# Altium project TMSVC5509A.PrjPcb
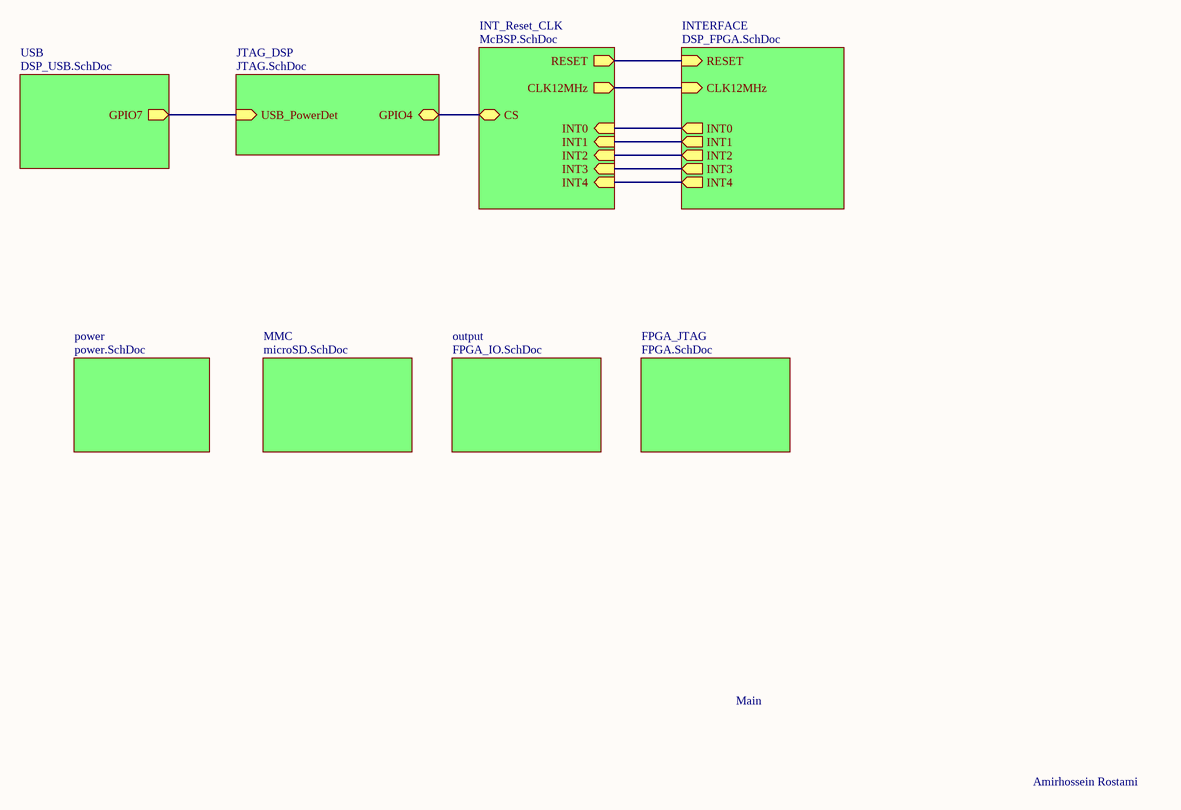
[diagram p0: main.SchDoc]
9 sheets, 303 parts. Net scope: hierarchical (ports join the sheet entries above them; power ports are global).
Board file: DSP5509_FPGACIII.PcbDoc
Sheets:
  main.SchDoc
    USB = DSP_USB.SchDoc
    JTAG_DSP = JTAG.SchDoc
    INT_Reset_CLK = McBSP.SchDoc
    INTERFACE = DSP_FPGA.SchDoc
    FPGA_JTAG = FPGA.SchDoc
    power = power.SchDoc
    MMC = microSD.SchDoc
    output = FPGA_IO.SchDoc

## Sheet main.SchDoc
size A4

### Sub-sheets
FPGA_JTAG = FPGA.SchDoc: no entries
INT_Reset_CLK = McBSP.SchDoc: CS, RESET (out), CLK12MHz (out), INT0 (in), INT1 (in), INT2 (in), INT3 (in), INT4 (in)
INTERFACE = DSP_FPGA.SchDoc: RESET (in), CLK12MHz (in), INT0 (out), INT1 (out), INT2 (out), INT3 (out), INT4 (out)
JTAG_DSP = JTAG.SchDoc: GPIO4, USB_PowerDet (in)
MMC = microSD.SchDoc: no entries
output = FPGA_IO.SchDoc: no entries
power = power.SchDoc: no entries
USB = DSP_USB.SchDoc: GPIO7 (out)

### Nets
CLK12MHz: sheet INT_Reset_CLK/CLK12MHz, sheet INTERFACE/CLK12MHz
NetR2_2: sheet USB/GPIO7, sheet JTAG_DSP/USB_PowerDet
NetR27_1: sheet JTAG_DSP/GPIO4, sheet INT_Reset_CLK/CS
NetR50_1: sheet INT_Reset_CLK/INT0, sheet INTERFACE/INT0
NetR51_1: sheet INT_Reset_CLK/INT1, sheet INTERFACE/INT1
NetR52_1: sheet INT_Reset_CLK/INT2, sheet INTERFACE/INT2
NetR53_1: sheet INT_Reset_CLK/INT3, sheet INTERFACE/INT3
NetR54_1: sheet INT_Reset_CLK/INT4, sheet INTERFACE/INT4
NetR145_2: sheet INT_Reset_CLK/RESET, sheet INTERFACE/RESET

### Notes on the sheet
- Main
- Amirhossein Rostami

## Sheet DSP_USB.SchDoc
size A4
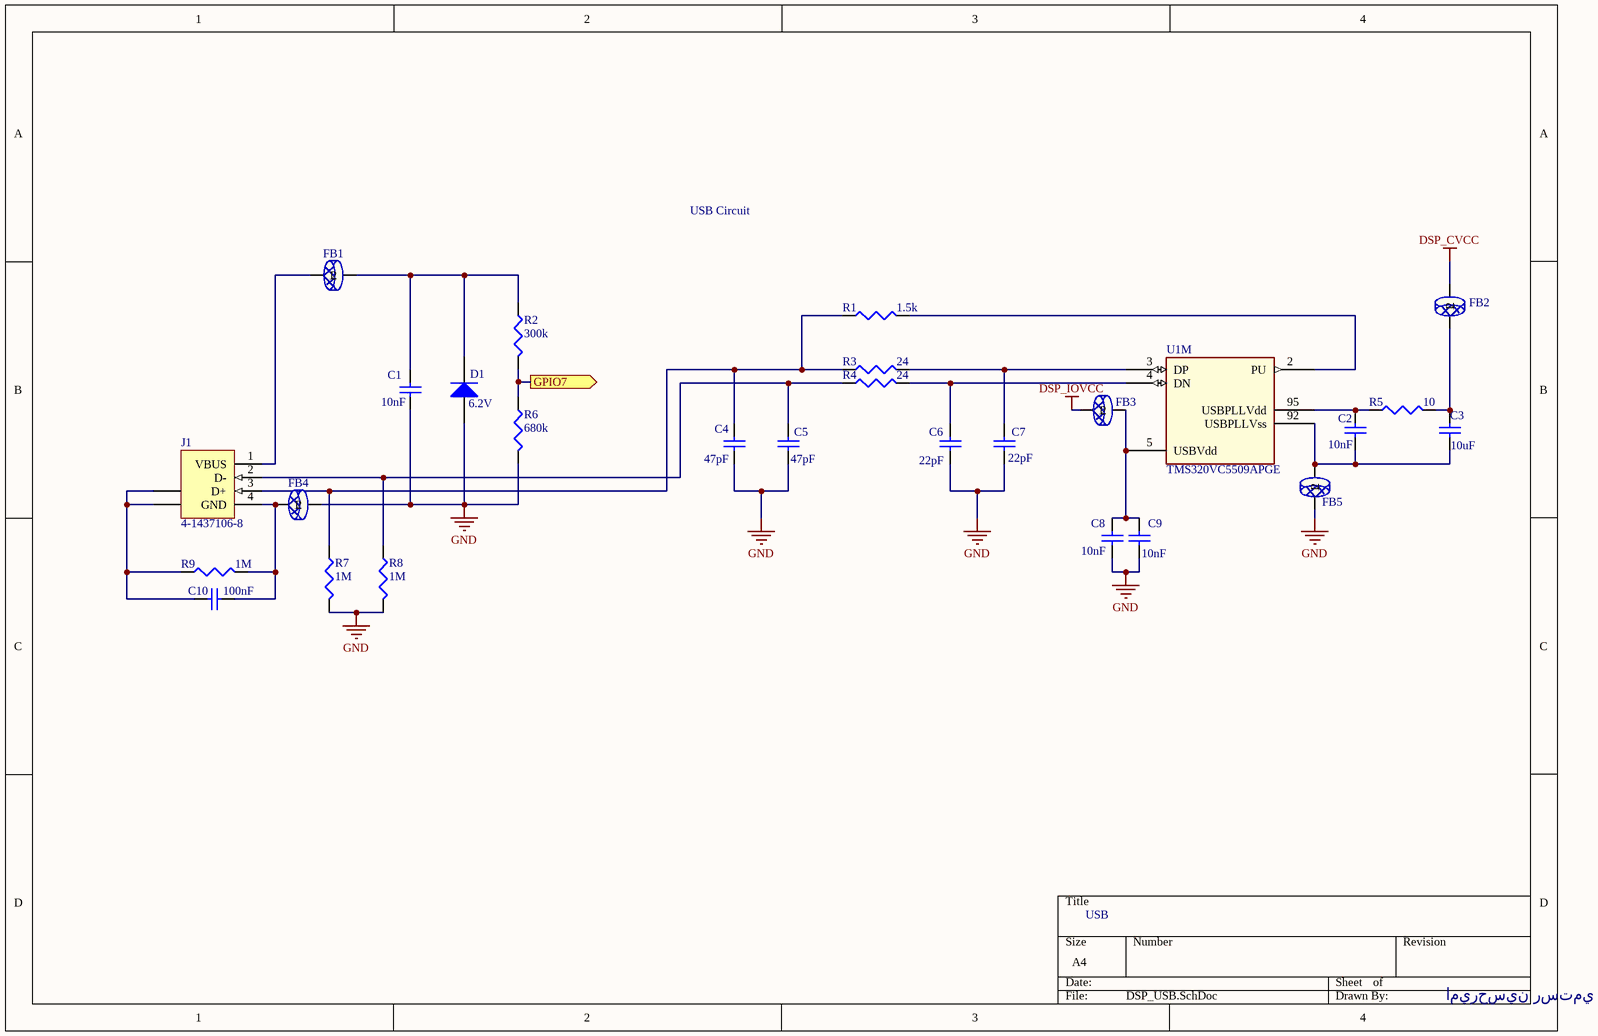
[diagram p1: DSP_USB.SchDoc]

### Parts
C1  10nF  [1608[0603]]
C2  10nF  [1608[0603]]
C3  10uF  [C1206]
C4  47pF  [1608[0603]]
C5  47pF  [1608[0603]]
C6  22pF  [1608[0603]]
C7  value 22pF  [1608[0603]]  (hidden comment: 24pF)
C8  10nF  [1608[0603]]
C9  10nF  [1608[0603]]
C10  100nF  [1608[0603]]
D1  6.2V  [MELF-D3513-1405]
FB1  50  [3216[1206]]  (value not drawn)
FB2  50  [3216[1206]]  (value not drawn)
FB3  50  [3216[1206]]  (value not drawn)
FB4  50  [3216[1206]]  (value not drawn)
FB5  50  [3216[1206]]  (value not drawn)
J1  4-1437106-8  [1437106]
R1  1.5k  [J1-0603]
R2  300k  [J1-0603]
R3  24  [J1-0603]
R4  24  [J1-0603]
R5  10  [J1-0603]
R6  680k  [J1-0603]
R7  1M  [J1-0603]
R8  1M  [J1-0603]
R9  1M  [J1-0603]
U1  TMS320VC5509APGE  [TMSVC5509APGA]  (part M of 16)

### Ports
GPIO7 (out)

### Nets
DSP_CVCC: FB2.1
DSP_IOVCC: FB3.2  [project net +3.3V]
GND: C1.2 C4.2 C5.2 C6.2 C7.2 C8.2 C9.2 D1.1(A) FB4.1 FB5.2 R6.2 R7.2 R8.2
NetC1_1: C1.1 D1.2(K) FB1.1 R2.1
NetC2_1: C2.1 R5.1 U1.95(USBPLLVdd)
NetC2_2: C2.2 C3.2 FB5.1 U1.92(USBPLLVss)
NetC3_1: C3.1 FB2.2 R5.2
NetC4_1: C4.1 J1.3(D+) R1.1 R3.1 R7.1
NetC5_1: C5.1 J1.2(D-) R4.1 R8.1
NetC6_1: C6.1 R4.2 U1.4(DN)
NetC7_1: C7.1 R3.2 U1.3(DP)
NetC8_1: C8.1 C9.1 FB3.1 U1.5(USBVdd)
NetC10_1: C10.1 FB4.2 J1.4(GND) R9.2
NetC10_2: C10.2 J1.5(SHLD) J1.6(SHLD) R9.1
NetFB1_2: FB1.2 J1.1(VBUS)
NetR1_2: R1.2 U1.2(PU)
NetR2_2: R2.2 R6.1 ; port GPIO7

### Notes on the sheet
- USB Circuit
- USB
- اميرحسين رستمي

### Library data of the parts
C1 C3-C10 = Cap Semi: Capacitor; Published: 8-Jun-2000; LatestRevisionDate: 17-Jul-2002; LatestRevisionNote: Re-released for DXP Platform.; PackageReference: C1206; Publisher: Altium Limited
  C1 C8 C9: Value: 10nF
  C3: Value: 10uF
  C4 C5: Value: 47pF
  C6: Value: 22pF
  C10: Value: 100nF
C2 = Cap Semi: Capacitor (Semiconductor SIM Model); Published: 8-Jun-2000; LatestRevisionDate: 17-Jul-2002; LatestRevisionNote: Re-released for DXP Platform.; PackageReference: C1206; Publisher: Altium Limited; Value: 10nF
D1 = Diode: Diode zener; Published: 8-Jun-2000; LatestRevisionDate: 17-Jul-2002; LatestRevisionNote: Re-released for DXP Platform.; PackageDocument: Sep-1996; PackageReference: SMC; Publisher: Altium Limited; Code_JEDEC: DO-214-AB
FB1-FB5 = Ferrite Bead
J1 = 4-1437106-8: USB 1.1, Right Angle, Thru-Hole, B Type, Receptacle, 4 Position, Natural; ContactMaterial: Copper Alloy; ContactPlating: Gold (30); TerminationLength: 2.90mm [0.114in.]; PCB_Layout: Complies with manufacturer's recommendation.; DrillSize: Corresponds to nominal value.; PanelGround: Without; Published: 15-Jul-2004; DatasheetDocument: 05-Jan-2004; PackageDocument: 05-Jan-2004; PackageReference: 1437106; Publisher: Altium Limited; HousingMaterial: Glass-Filled Thermoplastic; ComponentLink1Description: Manufacturer Link; ComponentLink1URL: http://www.tycoelectronics.com/; ComponentLink2Description: Packaging Specification; ComponentLink2URL: http://ecommas.tycoelectronics.com/commerce/DocumentDelivery/DDEController?Action=showdoc&DocId=Customer+Drawing%7F1437106%7FC%7Ftif%7FEnglish%7FENG_CD_1437106_C.tif
R1-R9 = Res3: Resistor; Published: 8-Jun-2000; LatestRevisionDate: 04-Mar-2005; LatestRevisionNote: PCB Footprint replaced.; PackageReference: J1-0603; Publisher: Altium Limited
  R1: Value: 1.5k
  R2: Value: 300k
  R3 R4: Value: 24
  R5: Value: 10
  R6: Value: 680k
  R7-R9: Value: 1M

## Sheet JTAG.SchDoc
size A4
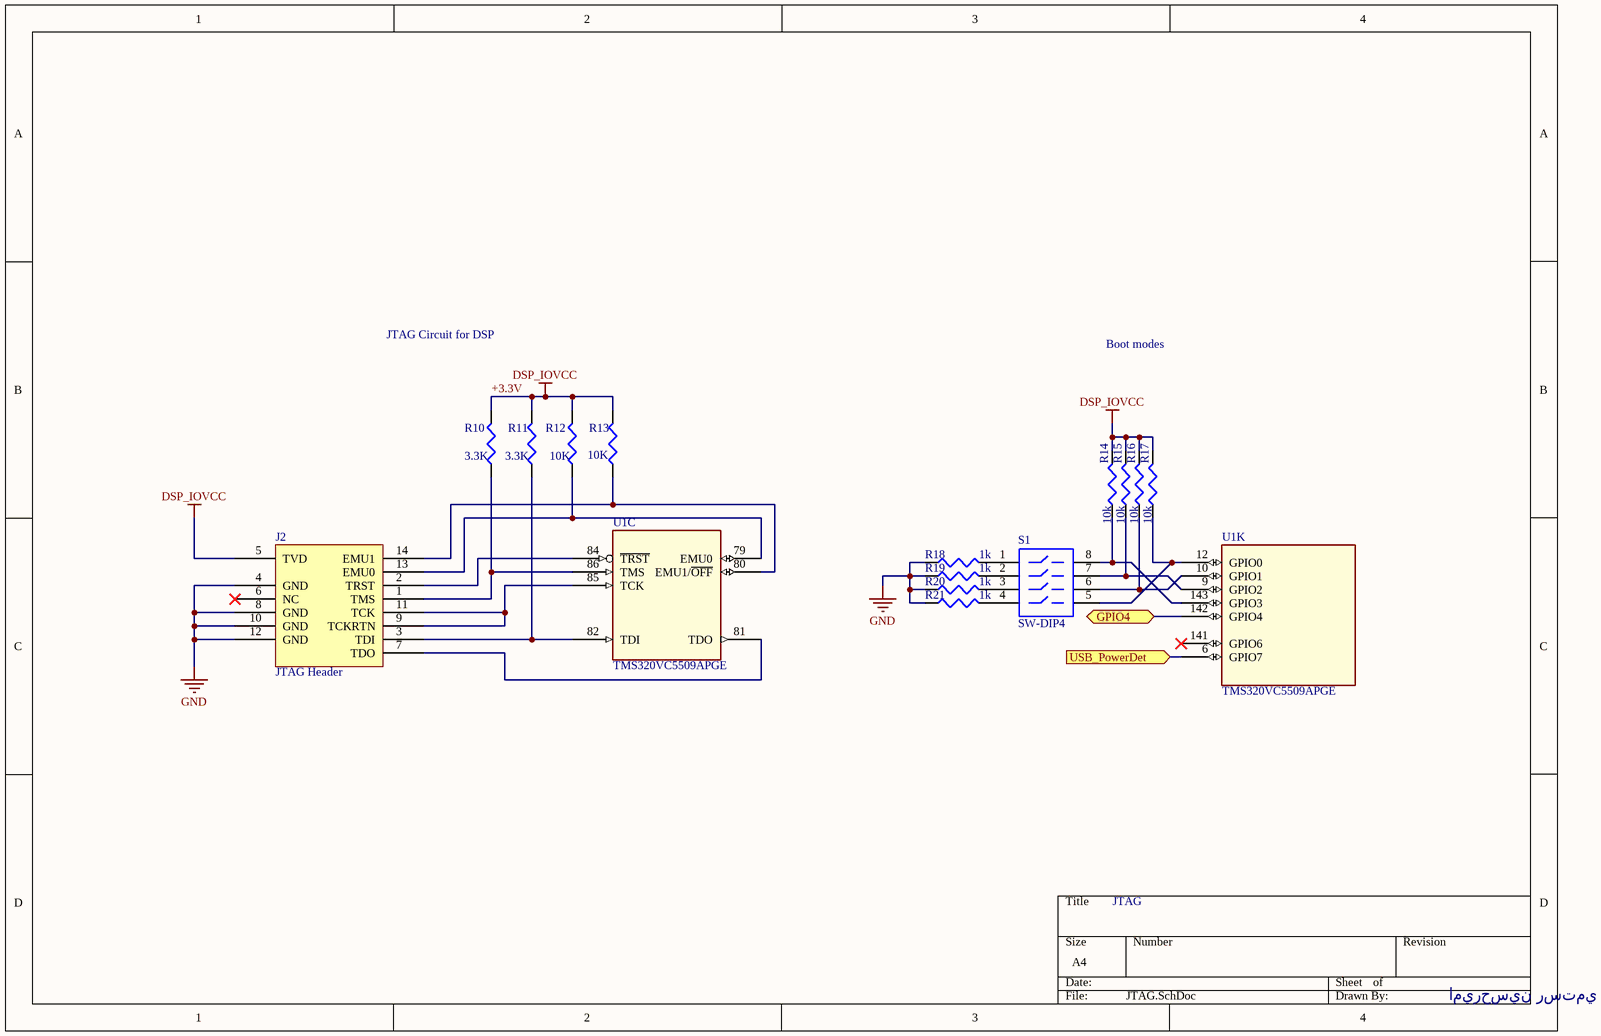
[diagram p2: JTAG.SchDoc]

### Parts
J2  JTAG Header  [HDR2X7]
R10  3.3k  [J1-0603]
R11  3.3k  [J1-0603]
R12  10k  [J1-0603]
R13  10k  [J1-0603]
R14  10k  [J1-0603]
R15  10k  [J1-0603]
R16  10k  [J1-0603]
R17  10k  [J1-0603]
R18  1k  [J1-0603]
R19  1k  [J1-0603]
R20  1k  [J1-0603]
R21  1k  [J1-0603]
S1  SW-DIP4  [DIP-8]
U1  TMS320VC5509APGE  [TMSVC5509APGA]  (parts C,K of 16)

### Ports
GPIO4, USB_PowerDet (in)

### Nets
+3.3V: J2.5(TVD) R10.2 R11.2 R12.2 R13.2 R14.2 R15.2 R16.2 R17.2  [also labelled DSP_IOVCC]
GND: J2.4(GND) J2.8(GND) J2.10(GND) J2.12(GND) R18.1 R19.1 R20.1 R21.1
NetJ2_1: J2.1(TMS) R10.1 U1.86(TMS)
NetJ2_2: J2.2(TRST) U1.84(~{TRST})
NetJ2_3: J2.3(TDI) R11.1 U1.82(TDI)
NetJ2_7: J2.7(TDO) U1.81(TDO)
NetJ2_9: J2.9(TCKRTN) J2.11(TCK) U1.85(TCK)
NetJ2_13: J2.13(EMU0) R12.1 U1.79(EMU0)
NetJ2_14: J2.14(EMU1) R13.1 U1.80(EMU1/~{OFF})
NetR2_2: U1.6(GPIO7) ; port USB_PowerDet
NetR14_1: R14.1 S1.8 U1.143(GPIO3)
NetR15_1: R15.1 S1.7 U1.9(GPIO2)
NetR16_1: R16.1 S1.6 U1.10(GPIO1)
NetR17_1: R17.1 S1.5 U1.12(GPIO0)
NetR18_2: R18.2 S1.1
NetR19_2: R19.2 S1.2
NetR20_2: R20.2 S1.3
NetR21_2: R21.2 S1.4
NetR27_1: U1.142(GPIO4) ; port GPIO4

Not connected (* = marked no-connect by the designer): J2 6(NC)*; U1 141(GPIO6)*

### Notes on the sheet
- JTAG Circuit for DSP
- Boot modes
- JTAG
- اميرحسين رستمي

### Library data of the parts
J2 = JTAG Header: JTAG Header for DSP 5509
R10-R21 = Res3: Resistor; Published: 8-Jun-2000; LatestRevisionDate: 04-Mar-2005; LatestRevisionNote: PCB Footprint replaced.; PackageReference: J1-0603; Publisher: Altium Limited
  R10 R11: Value: 3.3K
  R12 R13: Value: 10K
  R14-R17: Value: 10k
  R18-R21: Value: 1k
S1 = SW-DIP4: DIP Switch; Published: 24-Mar-1999; LatestRevisionDate: 17-Jul-2002; LatestRevisionNote: Re-released for DXP Platform.; PackageReference: DIP-8; Publisher: Altium Limited

## Sheet McBSP.SchDoc
size A4
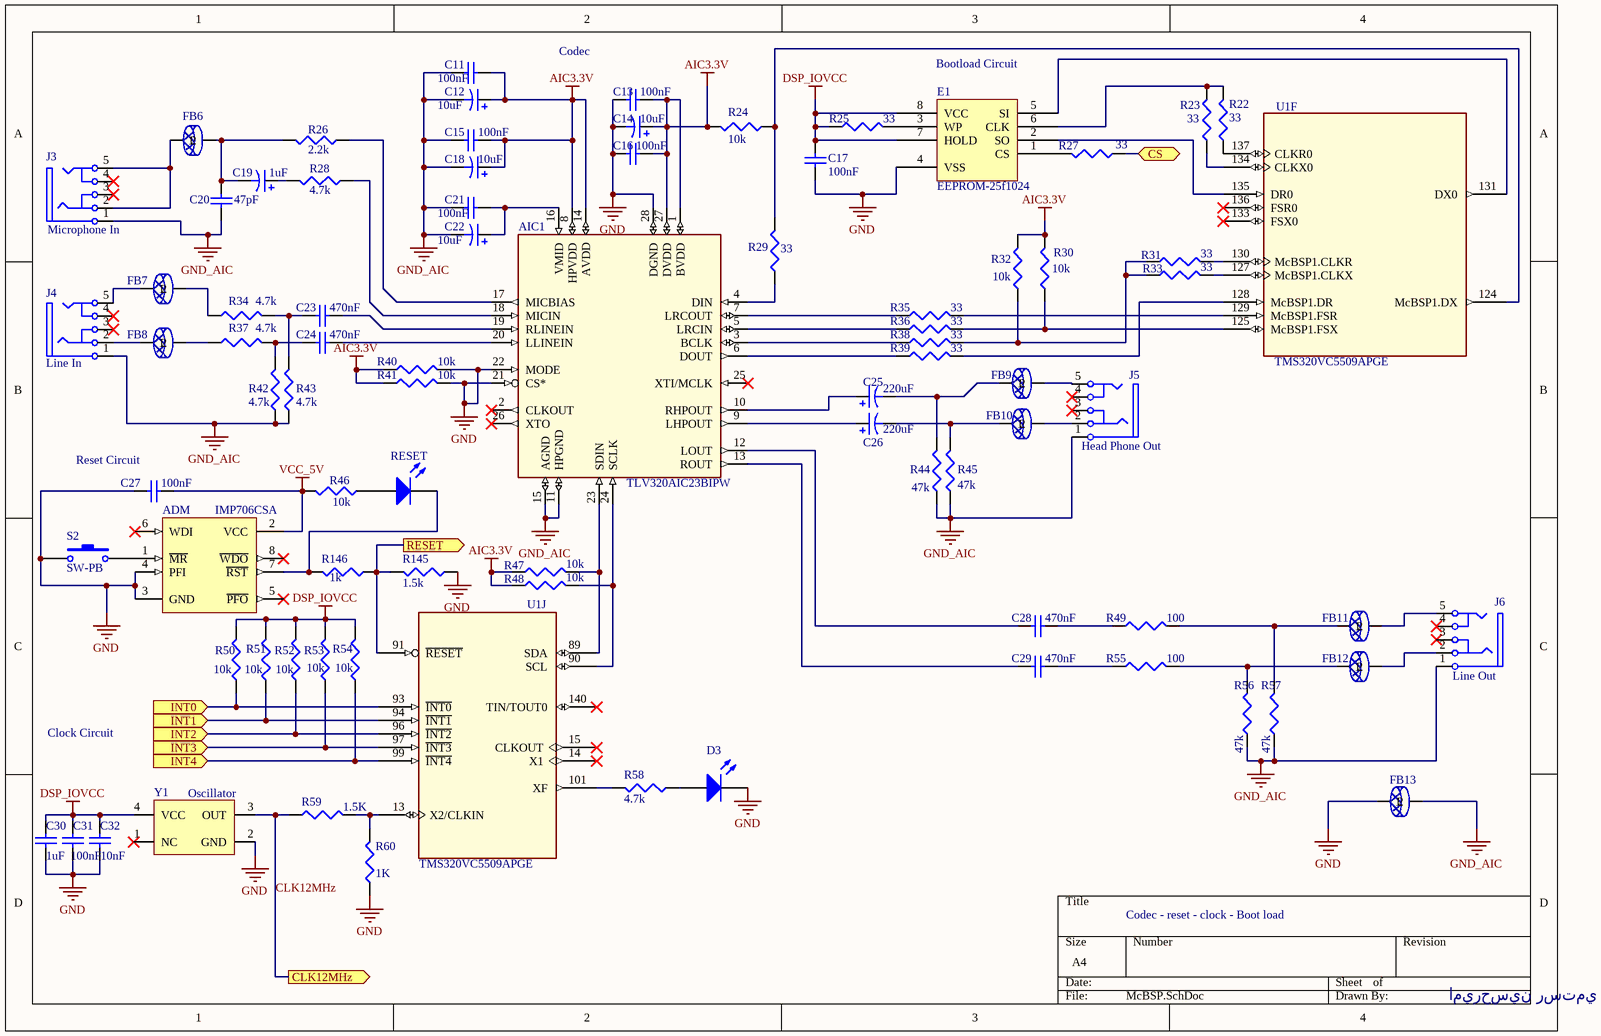
[diagram p3: McBSP.SchDoc]

### Parts
ADM  IMP706CSA  [SO-8_N]
AIC1  TLV320AIC23BIPW  [TSSOP28]
C11  100nF  [1608[0603]]
C12  10uF  [c1206]
C13  100nF  [1608[0603]]
C14  10uF  [c1206]
C15  100nF  [1608[0603]]
C16  100nF  [1608[0603]]
C17  100nF  [1608[0603]]
C18  10uF  [c1206]
C19  1uF  [c1206]
C20  47pF  [1608[0603]]
C21  100nF  [1608[0603]]
C22  10uF  [c1206]
C23  470nF  [1608[0603]]
C24  470nF  [1608[0603]]
C25  value 220uF  [TC7343-2917]  (hidden comment: Cap Pol3)
C26  220uF  [TC7343-2917]
C27  100nF  [1608[0603]]
C28  470nF  [1608[0603]]
C29  470nF  [1608[0603]]
C30  1uF  [1608[0603]]
C31  100nF  [1608[0603]]
C32  10nF  [1608[0603]]
D3  Green  [1.6x0.8x0.4]  (value not drawn)
E1  EEPROM-25f1024  [MX25l1605A]
FB6  50  [3216[1206]]  (value not drawn)
FB7  50  [3216[1206]]  (value not drawn)
FB8  50  [3216[1206]]  (value not drawn)
FB9  50  [3216[1206]]  (value not drawn)
FB10  50  [3216[1206]]  (value not drawn)
FB11  50  [3216[1206]]  (value not drawn)
FB12  50  [3216[1206]]  (value not drawn)
FB13  50  [3216[1206]]  (value not drawn)
J3  Microphone In  [stereo jack socket]
J4  Line In  [stereo jack socket]
J5  Head Phone Out  [stereo jack socket]
J6  Line Out  [stereo jack socket]
R22  33  [J1-0603]
R23  33  [J1-0603]
R24  10k  [J1-0603]
R25  33  [J1-0603]
R26  2.2k  [J1-0603]
R27  33  [J1-0603]
R28  4.7k  [J1-0603]
R29  33  [J1-0603]
R30  10k  [J1-0603]
R31  33  [J1-0603]
R32  10k  [J1-0603]
R33  33  [J1-0603]
R34  4.7k  [J1-0603]
R35  33  [J1-0603]
R36  33  [J1-0603]
R37  4.7K  [J1-0603]
R38  33  [J1-0603]
R39  33  [J1-0603]
R40  10k  [J1-0603]
R41  10k  [J1-0603]
R42  4.7k  [J1-0603]
R43  4.7k  [J1-0603]
R44  47k  [J1-0603]
R45  47k  [J1-0603]
R46  10k  [J1-0603]
R47  10k  [J1-0603]
R48  10k  [J1-0603]
R49  100  [J1-0603]
R50  10k  [J1-0603]
R51  10k  [J1-0603]
R52  10k  [J1-0603]
R53  10k  [J1-0603]
R54  10k  [J1-0603]
R55  100  [J1-0603]
R56  47k  [J1-0603]
R57  47k  [J1-0603]
R58  4.7k  [J1-0603]
R59  1.5k  [J1-0603]
R60  1k  [J1-0603]
R145  1.5k  [J1-0603]
R146  1k  [J1-0603]
RESET  LED RED  [1.6X0.8X0.4]  (value not drawn)
S2  SW-PB  [RESET_KEY]
U1  TMS320VC5509APGE  [TMSVC5509APGA]  (parts F,J of 16)
Y1  Oscillator  [Crystal oscillator]

### Ports
CLK12MHz (out), CS, INT0 (in), INT1 (in), INT2 (in), INT3 (in), INT4 (in), RESET (out)

### Nets
AIC3.3V: AIC1.1(BVDD) AIC1.8(HPVDD) AIC1.14(AVDD) AIC1.27(DVDD) C11.1 C12.1 C13.1 C14.1 C15.1 C16.1 C18.1 R24.2 R30.2 R32.2 R40.1 R41.1 R47.1 R48.1
DSP_IOVCC: C17.1 C30.1 C31.1 C32.1 E1.7(HOLD) E1.8(VCC) R25.1 R50.2 R51.2 R52.2 R53.2 R54.2 Y1.4(VCC)  [project net +3.3V]
GND: ADM.3(GND) ADM.4(PFI) AIC1.21(CS*) AIC1.22(MODE) AIC1.28(DGND) C13.2 C14.2 C16.2 C17.2 C27.1 C30.2 C31.2 C32.2 D3.2(K) E1.4(VSS) FB13.2 R40.2 R41.2 R60.1 R145.1 S2.1 Y1.2(GND)
GND_AIC: AIC1.11(HPGND) AIC1.15(AGND) C11.2 C12.2 C15.2 C18.2 C20.2 C21.2 C22.2 FB13.1 J3.1 J4.1 J5.1 J6.1 R42.1 R43.1 R44.1 R45.1 R56.1 R57.1
VCC_5V: ADM.2(VCC) C27.2 R46.2  [project net +5V]
CLK12MHz: R59.1 Y1.3(OUT) ; port CLK12MHz
NetADM_1: ADM.1(~{MR}) S2.2
NetADM_7: ADM.7(~{RST}) R146.2 RESET.2(K)
NetAIC1_3: AIC1.3(BCLK) R38.1
NetAIC1_4: AIC1.4(DIN) R29.1
NetAIC1_5: AIC1.5(LRCIN) R36.1
NetAIC1_6: AIC1.6(DOUT) R39.1
NetAIC1_7: AIC1.7(LRCOUT) R35.1
NetAIC1_9: AIC1.9(LHPOUT) C26.1
NetAIC1_10: AIC1.10(RHPOUT) C25.1
NetAIC1_12: AIC1.12(LOUT) C28.2
NetAIC1_13: AIC1.13(ROUT) C29.2
NetAIC1_16: AIC1.16(VMID) C21.1 C22.1
NetAIC1_17: AIC1.17(MICBIAS) R26.1
NetAIC1_18: AIC1.18(MICIN) R28.1
NetAIC1_19: AIC1.19(RLINEIN) C23.1
NetAIC1_20: AIC1.20(LLINEIN) C24.1
NetAIC1_23: AIC1.23(SDIN) R47.2 U1.89(SDA)
NetAIC1_24: AIC1.24(SCLK) R48.2 U1.90(SCL)
NetC19_1: C19.1 R28.2
NetC19_2: C19.2 C20.1 FB6.1 R26.2
NetC23_2: C23.2 R34.2 R43.2
NetC24_2: C24.2 R37.2 R42.2
NetC25_2: C25.2 FB9.2 R44.2
NetC26_2: C26.2 FB10.2 R45.2
NetC28_1: C28.1 R49.1
NetC29_1: C29.1 R55.1
NetD3_1: D3.1(A) R58.1
NetE1_1: E1.1(CS) R27.2
NetE1_2: E1.2(SO) U1.135(DR0)
NetE1_3: E1.3(WP) R25.2
NetE1_5: E1.5(SI) U1.131(DX0)
NetE1_6: E1.6(CLK) R22.2 R23.2
NetFB6_2: FB6.2 J3.2 J3.5
NetFB7_1: FB7.1 R34.1
NetFB7_2: FB7.2 J4.5
NetFB8_1: FB8.1 R37.1
NetFB8_2: FB8.2 J4.2
NetFB9_1: FB9.1 J5.5
NetFB10_1: FB10.1 J5.2
NetFB11_1: FB11.1 J6.5
NetFB11_2: FB11.2 R49.2 R57.2
NetFB12_1: FB12.1 J6.2
NetFB12_2: FB12.2 R55.2 R56.2
NetR22_1: R22.1 U1.137(CLKR0)
NetR23_1: R23.1 U1.134(CLKX0)
NetR24_1: R24.1 R29.2 U1.124(McBSP1.DX)
NetR27_1: R27.1 ; port CS
NetR30_1: R30.1 R36.2 U1.125(McBSP1.FSX)
NetR31_1: R31.1 R32.1 R33.1 R38.2
NetR31_2: R31.2 U1.130(McBSP1.CLKR)
NetR33_2: R33.2 U1.127(McBSP1.CLKX)
NetR35_2: R35.2 U1.129(McBSP1.FSR)
NetR39_2: R39.2 U1.128(McBSP1.DR)
NetR46_1: R46.1 RESET.1(A)
NetR50_1: R50.1 U1.93(~{INT0}) ; port INT0
NetR51_1: R51.1 U1.94(~{INT1}) ; port INT1
NetR52_1: R52.1 U1.96(~{INT2}) ; port INT2
NetR53_1: R53.1 U1.97(~{INT3}) ; port INT3
NetR54_1: R54.1 U1.99(~{INT4}) ; port INT4
NetR58_2: R58.2 U1.101(XF)
NetR59_2: R59.2 R60.2 U1.13(X2/CLKIN)
NetR145_2: R145.2 R146.1 U1.91(~{RESET}) ; port RESET

Not connected (* = marked no-connect by the designer): ADM 5(~{PFO})* 6(WDI)* 8(~{WDO})*; AIC1 2(CLKOUT)* 25(XTI/MCLK)* 26(XTO)*; J3 3* 4*; J4 3* 4*; J5 3* 4*; J6 3* 4*; U1 14(X1)* 15(CLKOUT)* 133(FSX0)* 136(FSR0)* 140(TIN/TOUT0)*; Y1 1(NC)*

### Notes on the sheet
- Codec
- (near E1) Bootload Circuit
- (near C27) Reset Circuit
- Clock Circuit
- Codec - reset - clock - Boot load
- اميرحسين رستمي

### Library data of the parts
ADM = ADM706AR: Low-Cost uP Supervisory Circuit; Published: 8-Jun-2000; LatestRevisionDate: 13-Apr-2006; LatestRevisionNote: IPC-7351 Footprint Added.; DatasheetVersion: REV.A 1996; PackageVersion: revA; PackageReference: SO-8; Publisher: Altium Limited; PackageDescription: 8-Pin Small Outline Integrated Circuit 1.27 mm Pitch; Code_JEDEC: MS-012-AA; Code_IPC: SOIC127P600-8; ComponentLink1Description: Manufacturer Link; ComponentLink1URL: http://www.analog.com/en/prod/0%2C2877%2CADM705%2C00.html; ComponentLink2Description: Datasheet; ComponentLink2URL: http://www.analog.com/UploadedFiles/Data_Sheets/28178114ADM705_6_7_8_c.pdf
C11 C13 C15-C17 C21 C23 C24 C27 C28 C30-C32 = Cap Semi: Capacitor; Published: 8-Jun-2000; LatestRevisionDate: 17-Jul-2002; LatestRevisionNote: Re-released for DXP Platform.; PackageReference: C1206; Publisher: Altium Limited
  C11 C13 C15-C17 C21 C27 C31: Value: 100nF
  C23 C24 C28: Value: 470nF
  C30: Value: 1uF
  C32: Value: 10nF
C12 C14 C18 C22 = Cap Pol3: Polarized Capacitor (Tantalium); Published: 8-Jun-2000; LatestRevisionDate: 17-Jul-2002; LatestRevisionNote: Re-released for DXP Platform.; PackageReference: C0805; Publisher: Altium Limited; Value: 10uF
C19 C26 = Cap Pol3: Polarized Capacitor; Published: 8-Jun-2000; LatestRevisionDate: 17-Jul-2002; LatestRevisionNote: Re-released for DXP Platform.; PackageReference: C0805; Publisher: Altium Limited
  C19: Value: 1uF
  C26: Value: 220uF
C20 C29 = Cap Semi: Capacitor (Semiconductor SIM Model); Published: 8-Jun-2000; LatestRevisionDate: 17-Jul-2002; LatestRevisionNote: Re-released for DXP Platform.; PackageReference: C1206; Publisher: Altium Limited
  C20: Value: 47pF
  C29: Value: 470nF
C25 = Cap Pol3: Polarized Capacitor (Surface Mount); Published: 8-Jun-2000; LatestRevisionDate: 17-Jul-2002; LatestRevisionNote: Re-released for DXP Platform.; PackageReference: C0805; Publisher: Altium Limited
D3 RESET = LED3: LED; Published: 8-Jun-2000; LatestRevisionDate: 17-Dec-2003; LatestRevisionNote: PCB Footprint replaced.; DatasheetDocument: 16-Apr-2002; PackageDocument: 16-Apr-2002; PackageReference: 3.5X2.8X1.9; Publisher: Altium Limited
E1 = EEPROM_25_256
FB6-FB13 = Ferrite Bead
J3-J6 = Stereo Jack Socket
R22-R60 R145 R146 = Res3: Resistor; Published: 8-Jun-2000; LatestRevisionDate: 04-Mar-2005; LatestRevisionNote: PCB Footprint replaced.; PackageReference: J1-0603; Publisher: Altium Limited
  R22 R23 R25 R27 R29 R31 R33 R35 R36 R38 R39: Value: 33
  R24 R30 R32 R40 R41 R46-R48 R50-R54: Value: 10k
  R26: Value: 2.2k
  R28 R34 R37 R42 R43 R58: Value: 4.7k
  R44 R45 R56 R57: Value: 47k
  R49 R55: Value: 100
  R59: Value: 1.5K
  R60: Value: 1K
  R145: Value: 1.5k
  R146: Value: 1k
S2 = SW-PB: Switch; Published: 24-Mar-1999; LatestRevisionDate: 17-Jul-2002; LatestRevisionNote: Re-released for DXP Platform.; PackageReference: SPST-2; Publisher: Altium Limited
Y1 = Crystall Oscillaotr

## Sheet DSP_FPGA.SchDoc
size A4
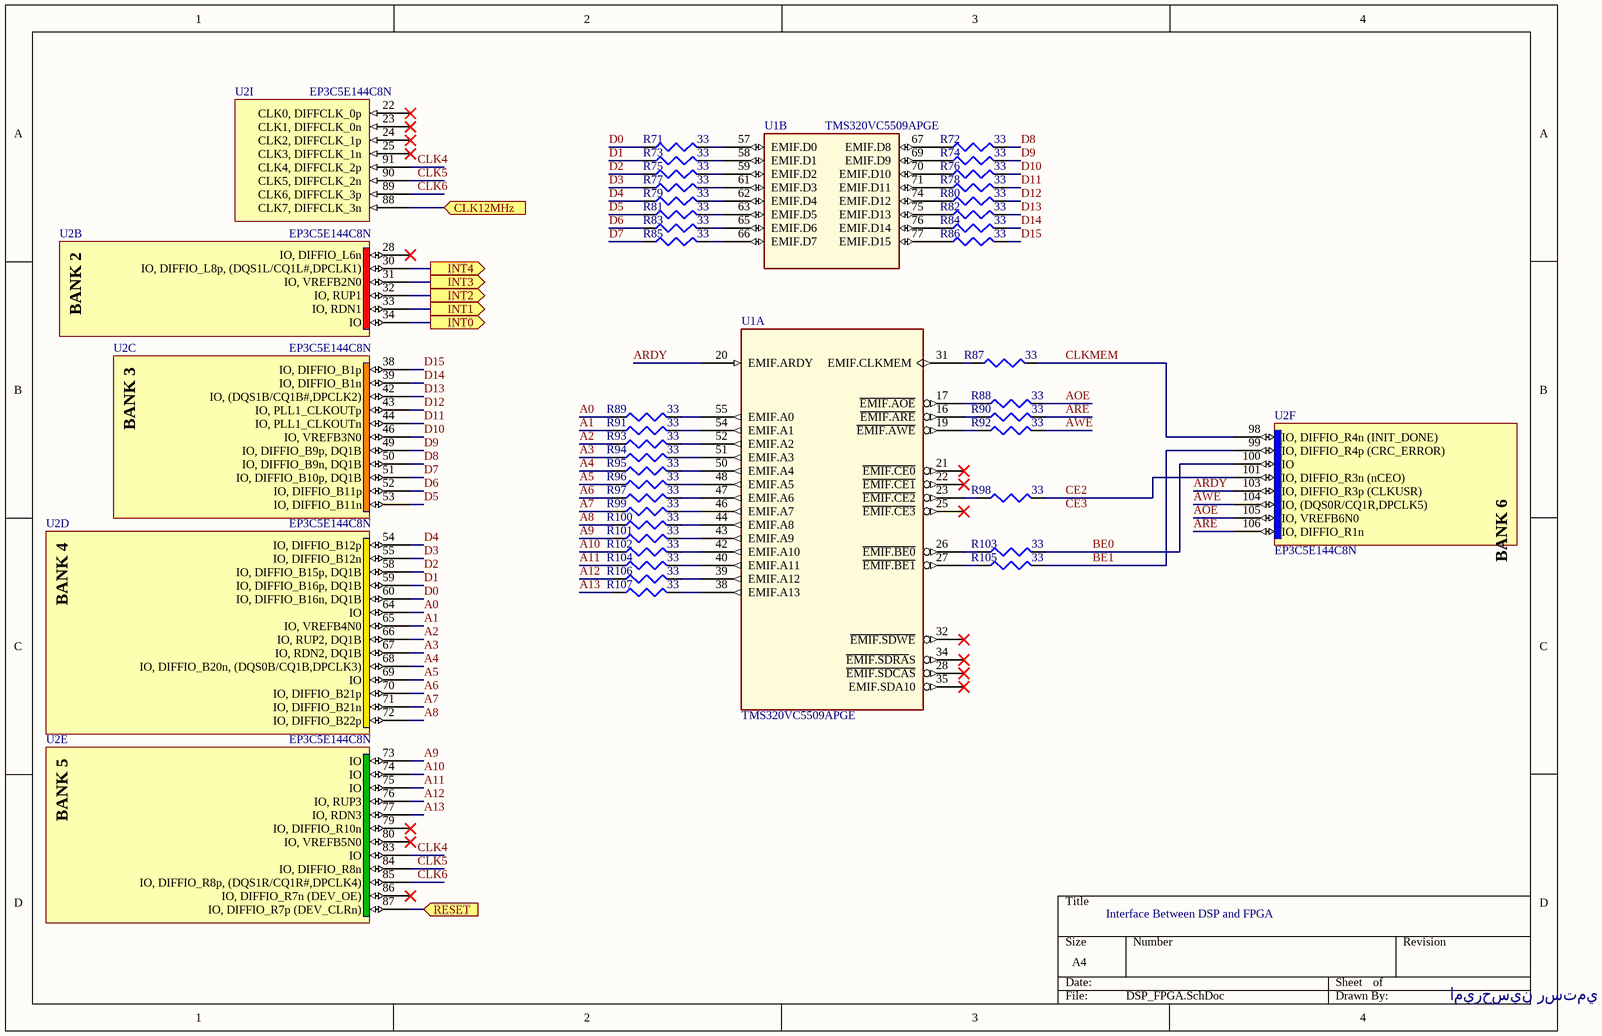
[diagram p4: DSP_FPGA.SchDoc]

### Parts
R71  33  [J1-0603]
R72  33  [J1-0603]
R73  33  [J1-0603]
R74  33  [J1-0603]
R75  33  [J1-0603]
R76  33  [J1-0603]
R77  33  [J1-0603]
R78  33  [J1-0603]
R79  33  [J1-0603]
R80  33  [J1-0603]
R81  33  [J1-0603]
R82  33  [J1-0603]
R83  33  [J1-0603]
R84  33  [J1-0603]
R85  33  [J1-0603]
R86  33  [J1-0603]
R87  33  [J1-0603]
R88  33  [J1-0603]
R89  33  [J1-0603]
R90  33  [J1-0603]
R91  33  [J1-0603]
R92  33  [J1-0603]
R93  33  [J1-0603]
R94  33  [J1-0603]
R95  33  [J1-0603]
R96  33  [J1-0603]
R97  33  [J1-0603]
R98  33  [J1-0603]
R99  33  [J1-0603]
R100  33  [J1-0603]
R101  33  [J1-0603]
R102  33  [J1-0603]
R103  33  [J1-0603]
R104  33  [J1-0603]
R105  33  [J1-0603]
R106  33  [J1-0603]
R107  33  [J1-0603]
U1  TMS320VC5509APGE  [TMSVC5509APGA]  (parts A,B of 16)
U2  EP3C5E144C8N  [EQFP144_N]  (parts B,C,D,E,F,I of 13)

### Ports
CLK12MHz (in), INT0 (out), INT1 (out), INT2 (out), INT3 (out), INT4 (out), RESET (in)

### Nets
A0: R89.2 U2.64(IO)
A1: R91.2 U2.65(IO,_VREFB4N0)
A2: R93.2 U2.66(IO,_RUP2,_DQ1B)
A3: R94.2 U2.67(IO,_RDN2,_DQ1B)
A4: R95.2 U2.68(IO,_DIFFIO_B20n,_(DQS0B/CQ1B,DPCLK3))
A5: R96.2 U2.69(IO)
A6: R97.2 U2.70(IO,_DIFFIO_B21p)
A7: R99.2 U2.71(IO,_DIFFIO_B21n)
A8: R100.2 U2.72(IO,_DIFFIO_B22p)
A9: R101.2 U2.73(IO)
A10: R102.2 U2.74(IO)
A11: R104.2 U2.75(IO)
A12: R106.2 U2.76(IO,_RUP3)
A13: R107.2 U2.77(IO,_RDN3)
AOE: R88.1 U2.105(IO,_VREFB6N0)
ARDY: U1.20(EMIF.ARDY) U2.103(IO,_DIFFIO_R3p_(CLKUSR))
ARE: R90.1 U2.106(IO,_DIFFIO_R1n)
AWE: R92.1 U2.104(IO,_(DQS0R/CQ1R,DPCLK5))
BE0: R103.1 U2.100(IO)
BE1: R105.1 U2.99(IO,_DIFFIO_R4p_(CRC_ERROR))
CE2: R98.1 U2.101(IO,_DIFFIO_R3n_(nCEO))
CLK4: U2.83(IO) U2.91(CLK4,_DIFFCLK_2p)
CLK5: U2.84(IO,_DIFFIO_R8n) U2.90(CLK5,_DIFFCLK_2n)
CLK6: U2.85(IO,_DIFFIO_R8p,_(DQS1R/CQ1R#,DPCLK4)) U2.89(CLK6,_DIFFCLK_3p)
CLK12MHz: U2.88(CLK7,_DIFFCLK_3n) ; port CLK12MHz
CLKMEM: R87.1 U2.98(IO,_DIFFIO_R4n_(INIT_DONE))
D0: R71.1 U2.60(IO,_DIFFIO_B16n,_DQ1B)
D1: R73.1 U2.59(IO,_DIFFIO_B16p,_DQ1B)
D2: R75.1 U2.58(IO,_DIFFIO_B15p,_DQ1B)
D3: R77.1 U2.55(IO,_DIFFIO_B12n)
D4: R79.1 U2.54(IO,_DIFFIO_B12p)
D5: R81.1 U2.53(IO,_DIFFIO_B11n)
D6: R83.1 U2.52(IO,_DIFFIO_B11p)
D7: R85.1 U2.51(IO,_DIFFIO_B10p,_DQ1B)
D8: R72.2 U2.50(IO,_DIFFIO_B9n,_DQ1B)
D9: R74.2 U2.49(IO,_DIFFIO_B9p,_DQ1B)
D10: R76.2 U2.46(IO,_VREFB3N0)
D11: R78.2 U2.44(IO,_PLL1_CLKOUTn)
D12: R80.2 U2.43(IO,_PLL1_CLKOUTp)
D13: R82.2 U2.42(IO,_(DQS1B/CQ1B#,DPCLK2))
D14: R84.2 U2.39(IO,_DIFFIO_B1n)
D15: R86.2 U2.38(IO,_DIFFIO_B1p)
NetR50_1: U2.34(IO) ; port INT0
NetR51_1: U2.33(IO,_RDN1) ; port INT1
NetR52_1: U2.32(IO,_RUP1) ; port INT2
NetR53_1: U2.31(IO,_VREFB2N0) ; port INT3
NetR54_1: U2.30(IO,_DIFFIO_L8p,_(DQS1L/CQ1L#,DPCLK1)) ; port INT4
NetR71_2: R71.2 U1.57(EMIF.D0)
NetR72_1: R72.1 U1.67(EMIF.D8)
NetR73_2: R73.2 U1.58(EMIF.D1)
NetR74_1: R74.1 U1.69(EMIF.D9)
NetR75_2: R75.2 U1.59(EMIF.D2)
NetR76_1: R76.1 U1.70(EMIF.D10)
NetR77_2: R77.2 U1.61(EMIF.D3)
NetR78_1: R78.1 U1.71(EMIF.D11)
NetR79_2: R79.2 U1.62(EMIF.D4)
NetR80_1: R80.1 U1.74(EMIF.D12)
NetR81_2: R81.2 U1.63(EMIF.D5)
NetR82_1: R82.1 U1.75(EMIF.D13)
NetR83_2: R83.2 U1.65(EMIF.D6)
NetR84_1: R84.1 U1.76(EMIF.D14)
NetR85_2: R85.2 U1.66(EMIF.D7)
NetR86_1: R86.1 U1.77(EMIF.D15)
NetR87_2: R87.2 U1.31(EMIF.CLKMEM)
NetR88_2: R88.2 U1.17(~{EMIF.AOE})
NetR89_1: R89.1 U1.55(EMIF.A0)
NetR90_2: R90.2 U1.16(~{EMIF.ARE})
NetR91_1: R91.1 U1.54(EMIF.A1)
NetR92_2: R92.2 U1.19(~{EMIF.AWE})
NetR93_1: R93.1 U1.52(EMIF.A2)
NetR94_1: R94.1 U1.51(EMIF.A3)
NetR95_1: R95.1 U1.50(EMIF.A4)
NetR96_1: R96.1 U1.48(EMIF.A5)
NetR97_1: R97.1 U1.47(EMIF.A6)
NetR98_2: R98.2 U1.23(~{EMIF.CE2})
NetR99_1: R99.1 U1.46(EMIF.A7)
NetR100_1: R100.1 U1.44(EMIF.A8)
NetR101_1: R101.1 U1.43(EMIF.A9)
NetR102_1: R102.1 U1.42(EMIF.A10)
NetR103_2: R103.2 U1.26(~{EMIF.BE0})
NetR104_1: R104.1 U1.40(EMIF.A11)
NetR105_2: R105.2 U1.27(~{EMIF.BE1})
NetR106_1: R106.1 U1.39(EMIF.A12)
NetR107_1: R107.1 U1.38(EMIF.A13)
NetR145_2: U2.87(IO,_DIFFIO_R7p_(DEV_CLRn)) ; port RESET

Not connected (* = marked no-connect by the designer): U1 21(~{EMIF.CE0})* 22(~{EMIF.CE1})* 25(~{EMIF.CE3})* 28(~{EMIF.SDCAS})* 32(~{EMIF.SDWE})* 34(~{EMIF.SDRA}S)* 35(EMIF.SDA10)*; U2 22(CLK0,_DIFFCLK_0p)* 23(CLK1,_DIFFCLK_0n)* 24(CLK2,_DIFFCLK_1p)* 25(CLK3,_DIFFCLK_1n)* 28(IO,_DIFFIO_L6n)* 79(IO,_DIFFIO_R10n)* 80(IO,_VREFB5N0)* 86(IO,_DIFFIO_R7n_(DEV_OE))*

### Notes on the sheet
- Interface Between DSP and FPGA
- اميرحسين رستمي
- Labels drawn without touching a wire or pin: CE3
- (in symbol EP3C5E144C8N, part B) BANK 2
- (in symbol EP3C5E144C8N, part C) BANK 3
- (in symbol EP3C5E144C8N, part D) BANK 4
- (in symbol EP3C5E144C8N, part E) BANK 5
- (in symbol EP3C5E144C8N, part F) BANK 6

### Library data of the parts
R71-R107 = Res3: Resistor; Published: 8-Jun-2000; LatestRevisionDate: 04-Mar-2005; LatestRevisionNote: PCB Footprint replaced.; PackageReference: J1-0603; Publisher: Altium Limited; Value: 33
U2 = EP3C5E144C8N: Cyclone III Family FPGA, 94 I/O Pins, 4 PLLs, 144-Pin EQFP, Speed Grade 8, Commercial Grade, Pb-Free; Note: Exposed pad at the bottom of this package must be connected to PCB GND.; Published: 14-Mar-2008; LatestRevisionDate: 27-Jun-2008; LatestRevisionNote: Sch pin for exposed pad added.; DatasheetVersion: ver2.0, May-2008; PackageVersion: ver15.1, May-2008; PackageReference: EQFP144; Publisher: Altium Limited; PackageDescription: 144-Pin Plastic Enhanced Quad Flat Pack (EQFP144) - Wire Bond; Code_JEDEC: MS-026-BFB; ComponentLink1Description: Manufacturer Link; ComponentLink1URL: http://www.altera.com/; ComponentLink2Description: Handbook (7.86MB); ComponentLink2URL: http://www.altera.com/literature/hb/cyc3/cyclone3_handbook.pdf; ComponentLink3Description: Packaging Specification; ComponentLink3URL: http://www.altera.com/literature/ds/dspkg.pdf

## Sheet FPGA.SchDoc
size A4; PageSetup: Record=PageOptions|CenterHorizontal=True|CenterVertical=True|PrintScale=0.94|XCorrection=1.00|YCorrection=1.00|PrintKind=1|BorderSize=5000000|LeftOffset=0|BottomOffset=0|Orientation=2|PaperLength=1000|PaperWidth=1000|Scale=100|PaperSource=15|PrintQuality=1200|MediaType=1|DitherType=10|PaperKind=Letter|PrintScaleMode=1
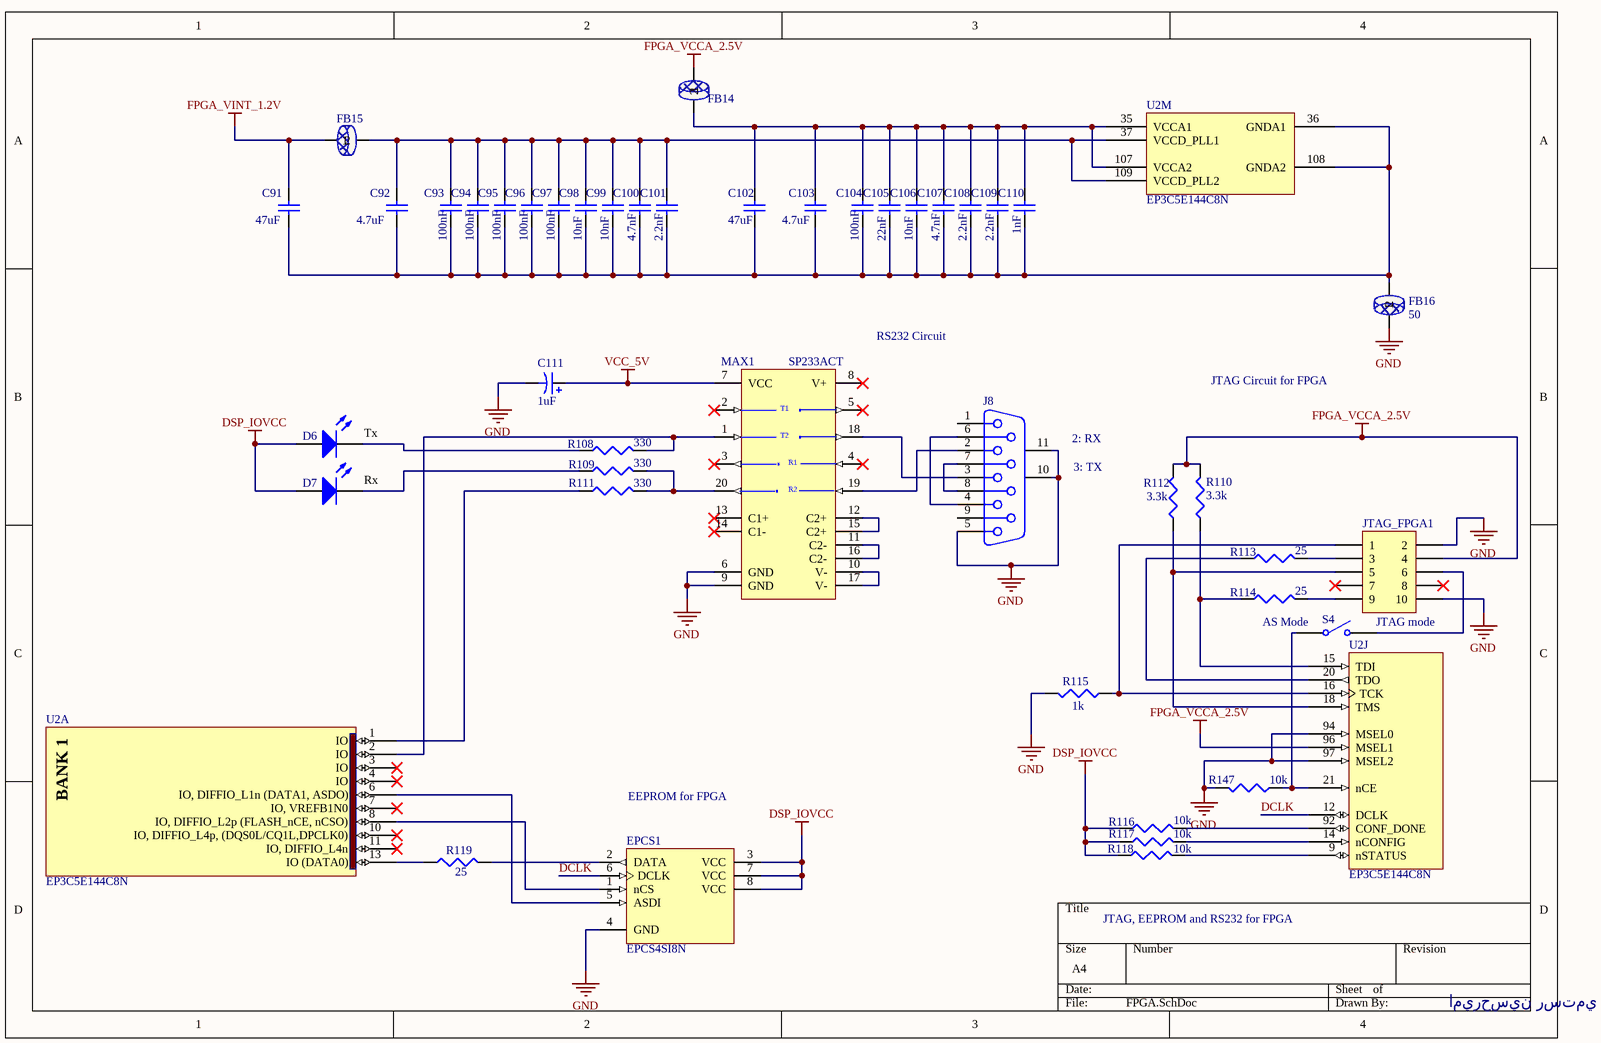
[diagram p5: FPGA.SchDoc]

### Parts
C91  value 47uF  [C1206]  (hidden comment: 470uF)
C92  4.7uF  [1608[0603]]
C93  100nF  [1608[0603]]
C94  100nF  [1608[0603]]
C95  100nF  [1608[0603]]
C96  100nF  [1608[0603]]
C97  100nF  [1608[0603]]
C98  10nF  [1608[0603]]
C99  10nF  [1608[0603]]
C100  4.7nF  [1608[0603]]
C101  2.2nF  [1608[0603]]
C102  47uF  [C1206]
C103  4.7uF  [1608[0603]]
C104  100nF  [1608[0603]]
C105  22nF  [1608[0603]]
C106  10nF  [1608[0603]]
C107  4.7nF  [1608[0603]]
C108  2.2nF  [1608[0603]]
C109  2.2nF  [1608[0603]]
C110  1nF  [1608[0603]]
C111  1uF  [C1206]
D6  Yellow  [1.6X0.8X0.4]  (value not drawn)
D7  Yellow  [1.6X0.8X0.4]  (value not drawn)
EPCS1  EPCS4SI8N  [SOIC8_M]
FB14  Ferrite Bead  [3216[1206]]  (value not drawn)
FB15  50  [3216[1206]]  (value not drawn)
FB16  50  [3216[1206]]
J8  D Connector 9  [DSUB1.385-2H9]  (value not drawn)
JTAG_FPGA1  Header 5X2  [HDR2X5]  (value not drawn)
MAX1  SP233ACT  [WSO20_L]
R108  330  [J1-0603]
R109  330  [J1-0603]
R110  3.3k  [J1-0603]
R111  330  [J1-0603]
R112  3.3k  [J1-0603]
R113  25  [J1-0603]
R114  25  [J1-0603]
R115  1k  [J1-0603]
R116  10k  [J1-0603]
R117  10k  [J1-0603]
R118  10k  [J1-0603]
R119  25  [J1-0603]
R147  10k  [J1-0603]
S4  SW-SPST  [DIP_SW_1]  (value not drawn)
U2  EP3C5E144C8N  [EQFP144_N]  (parts A,J,M of 13)

### Nets
DSP_IOVCC: D6.1(A) D7.1(A) EPCS1.3(VCC) EPCS1.7(VCC) EPCS1.8(VCC) R116.1 R117.1 R118.1  [project net +3.3V]
FPGA_VCCA_2.5V: FB14.2 JTAG_FPGA1.4 R110.2 R112.2 U2.96(MSEL1)
FPGA_VINT_1.2V: C91.1 FB15.2
GND: C111.2 EPCS1.4(GND) FB16.2 J8.5 J8.10(MH1) J8.11(MH2) JTAG_FPGA1.2 JTAG_FPGA1.10 MAX1.6(GND) MAX1.9(GND) R115.2 R147.2 U2.94(MSEL0) U2.97(MSEL2)
VCC_5V: C111.1 MAX1.7(VCC)  [project net +5V]
DCLK: EPCS1.6(DCLK) U2.12(DCLK)
NetC91_2: C91.2 C92.2 C93.2 C94.2 C95.2 C96.2 C97.2 C98.2 C99.2 C100.2 C101.2 C102.2 C103.2 C104.2 C105.2 C106.2 C107.2 C108.2 C109.2 C110.2 FB16.1 U2.36(GNDA1) U2.108(GNDA2)
NetC92_1: C92.1 C93.1 C94.1 C95.1 C96.1 C97.1 C98.1 C99.1 C100.1 C101.1 FB15.1 U2.37(VCCD_PLL1) U2.109(VCCD_PLL2)
NetC102_1: C102.1 C103.1 C104.1 C105.1 C106.1 C107.1 C108.1 C109.1 C110.1 FB14.1 U2.35(VCCA1) U2.107(VCCA2)
NetD6_2: D6.2(K) R108.1
NetD7_2: D7.2(K) R109.1
NetEPCS1_1: EPCS1.1(nCS) U2.8(IO,_DIFFIO_L2p_(FLASH_nCE,_nCSO))
NetEPCS1_2: EPCS1.2(DATA) R119.2
NetEPCS1_5: EPCS1.5(ASDI) U2.6(IO,_DIFFIO_L1n_(DATA1,_ASDO))
NetJ8_2: J8.2 MAX1.19(R2IN)
NetJ8_3: J8.3 MAX1.18(T2OUT)
NetJ8_4: J8.4 J8.6
NetJ8_7: J8.7 J8.8
NetJTAG_FPGA1_1: JTAG_FPGA1.1 R115.1 U2.16(TCK)
NetJTAG_FPGA1_3: JTAG_FPGA1.3 R113.2
NetJTAG_FPGA1_5: JTAG_FPGA1.5 R112.1 U2.18(TMS)
NetJTAG_FPGA1_6: JTAG_FPGA1.6 S4.2(NO)
NetJTAG_FPGA1_9: JTAG_FPGA1.9 R114.2
NetMAX1_1: MAX1.1(T2IN) R108.2 U2.2(IO)
NetMAX1_10: MAX1.10(V-) MAX1.17(V-)
NetMAX1_11: MAX1.11(C2-) MAX1.16(C2-)
NetMAX1_12: MAX1.12(C2+) MAX1.15(C2+)
NetMAX1_20: MAX1.20(R2OUT) R109.2 R111.2
NetR110_1: R110.1 R114.1 U2.15(TDI)
NetR111_1: R111.1 U2.1(IO)
NetR113_1: R113.1 U2.20(TDO)
NetR116_2: R116.2 U2.92(CONF_DONE)
NetR117_2: R117.2 U2.14(nCONFIG)
NetR118_2: R118.2 U2.9(nSTATUS)
NetR119_1: R119.1 U2.13(IO_(DATA0))
NetR147_1: R147.1 S4.1(COMMON) U2.21(nCE)

Not connected (* = marked no-connect by the designer): J8 1 9; JTAG_FPGA1 7* 8*; MAX1 2(T1IN)* 3(R1OUT)* 4(R1IN)* 5(T1OUT)* 8(V+)* 13(C1+)* 14(C1-)*; U2 3(IO)* 4(IO)* 7(IO,_VREFB1N0)* 10(IO,_DIFFIO_L4p,_(DQS0L/CQ1L,DPCLK0))* 11(IO,_DIFFIO_L4n)*

### Notes on the sheet
- RS232 Circuit
- JTAG Circuit for FPGA
- (near D6) Tx
- (near J8) 2: RX
- Rx
- 3: TX
- AS Mode
- JTAG mode
- EEPROM for FPGA
- JTAG, EEPROM and RS232 for FPGA
- اميرحسين رستمي
- (in symbol EP3C5E144C8N, part A) BANK 1
- (in symbol MAX233AEWP) T1; T2; R1; R2

### Library data of the parts
C91-C110 = Cap Semi: Capacitor; Published: 8-Jun-2000; LatestRevisionDate: 17-Jul-2002; LatestRevisionNote: Re-released for DXP Platform.; PackageReference: C1206; Publisher: Altium Limited
  C92 C103: Value: 4.7uF
  C93-C97 C104: Value: 100nF
  C98 C99 C106: Value: 10nF
  C100 C107: Value: 4.7nF
  C101 C108 C109: Value: 2.2nF
  C102: Value: 47uF
  C105: Value: 22nF
  C110: Value: 1nF
C111 = Cap Pol3: Polarized Capacitor; Published: 8-Jun-2000; LatestRevisionDate: 17-Jul-2002; LatestRevisionNote: Re-released for DXP Platform.; PackageReference: C0805; Publisher: Altium Limited; Value: 1uF
D6 D7 = LED3: LED; Published: 8-Jun-2000; LatestRevisionDate: 17-Dec-2003; LatestRevisionNote: PCB Footprint replaced.; DatasheetDocument: 16-Apr-2002; PackageDocument: 16-Apr-2002; PackageReference: 3.5X2.8X1.9; Publisher: Altium Limited
EPCS1 = EPCS4SI8N: EPCS4 Series, In-system programmable 3.3V serial configuration device, 8-Pin SOIC, 4-Megabit, Industrial Grade, Pb-Free; Configures: Cyclone II, Stratix II, & Cyclone Devices; Published: 4-Mar-2005; LatestRevisionDate: 13-Apr-2006; LatestRevisionNote: IPC-7351 Footprint Added.; DatasheetVersion: ver2.0, Oct-2003; PackageVersion: ver13.0, May-2005; PackageReference: SOIC8; Publisher: Altium Limited; PackageDescription: 8-Pin Small Outline Integrated Circuit Package (SOIC8); Code_JEDEC: MS-012-AA; Code_IPC: SOIC127P600-8; ComponentLink1Description: Manufacturer Link; ComponentLink1URL: http://www.altera.com/products/devices/config/cfg-index.html; ComponentLink2Description: Configuration Handbook; ComponentLink2URL: http://www.altera.com/literature/hb/cfg/config_handbook.pdf; ComponentLink3Description: Pinout Specification; ComponentLink3URL: http://www.altera.com/literature/hb/cfg/cyc_c51014.pdf; ComponentLink4Description: Packaging Specification; ComponentLink4URL: http://www.altera.com/literature/ds/dspkg.pdf
FB15 FB16 = Ferrite Bead
J8 = D Connector 9: Receptacle Assembly, 9 Position, Right Angle; PackageDocument: O; Positions: 9; Published: 15-Jun-2001; LatestRevisionDate: 17-Jul-2002; LatestRevisionNote: Re-released for DXP Platform.; DatasheetDocument: 1-Sep-1999; PackageReference: 788750; Publisher: Altium Limited; Orientation: Right Angle; Gender: Receptacle
JTAG_FPGA1 = Header 5X2: Header, 5-Pin, Dual row; LatestRevisionDate: 17-Jul-2002; LatestRevisionNote: Re-released for DXP Platform.; Publisher: Altium Limited
MAX1 = MAX233AEWP: +5V-Powered, Multichannel RS-232 Driver/Receiver; Published: 16-Jan-2001; LatestRevisionDate: 13-Apr-2006; LatestRevisionNote: IPC-7351 Footprint Added.; DatasheetVersion: Nov-1997; PackageReference: WSO20; Publisher: Altium Limited; PackageDescription: 20-Pin Small Outline Integrated Circuit 1.27 mm Pitch; Code_JEDEC: MS-013-AC; Code_IPC: SOIC127P1030-20; ComponentLink1Description: Manufacturer Link; ComponentLink1URL: http://www.maxim-ic.com/; ComponentLink2Description: Datasheet; ComponentLink2URL: http://pdfserv.maxim-ic.com/en/ds/MAX220-MAX249.pdf
R108-R119 R147 = Res3: Resistor; Published: 8-Jun-2000; LatestRevisionDate: 04-Mar-2005; LatestRevisionNote: PCB Footprint replaced.; PackageReference: J1-0603; Publisher: Altium Limited
  R108 R109 R111: Value: 330
  R110 R112: Value: 3.3k
  R113 R114 R119: Value: 25
  R115: Value: 1k
  R116-R118 R147: Value: 10k
S4 = SW-SPST: Single-Pole, Single-Throw Switch; Published: 24-Mar-1999; LatestRevisionDate: 17-Jul-2002; LatestRevisionNote: Re-released for DXP Platform.; PackageReference: SPST-2; Publisher: Altium Limited
U2 = EP3C5E144C8N: as U2 on sheet DSP_FPGA; Published: 14-Mar-2008; LatestRevisionDate: 27-Jun-2008; LatestRevisionNote: Sch pin for exposed pad added.; DatasheetVersion: ver2.0, May-2008; PackageVersion: ver15.1, May-2008; PackageReference: EQFP144; Publisher: Altium Limited; PackageDescription: 144-Pin Plastic Enhanced Quad Flat Pack (EQFP144) - Wire Bond; Code_JEDEC: MS-026-BFB; ComponentLink1Description: Manufacturer Link; ComponentLink1URL: http://www.altera.com/; ComponentLink2Description: Handbook (7.86MB); ComponentLink2URL: http://www.altera.com/literature/hb/cyc3/cyclone3_handbook.pdf; ComponentLink3Description: Packaging Specification; ComponentLink3URL: http://www.altera.com/literature/ds/dspkg.pdf

## Sheet power.SchDoc
size A4; PageSetup: Record=PageOptions|CenterHorizontal=True|CenterVertical=True|PrintScale=1.00|XCorrection=1.00|YCorrection=1.00|PrintKind=1|BorderSize=5000000|LeftOffset=0|BottomOffset=0|Orientation=2|PaperLength=1000|PaperWidth=1000|Scale=100|PaperSource=7|PrintQuality=-4|MediaType=1|DitherType=10|PaperKind=A4|PrintScaleMode=1
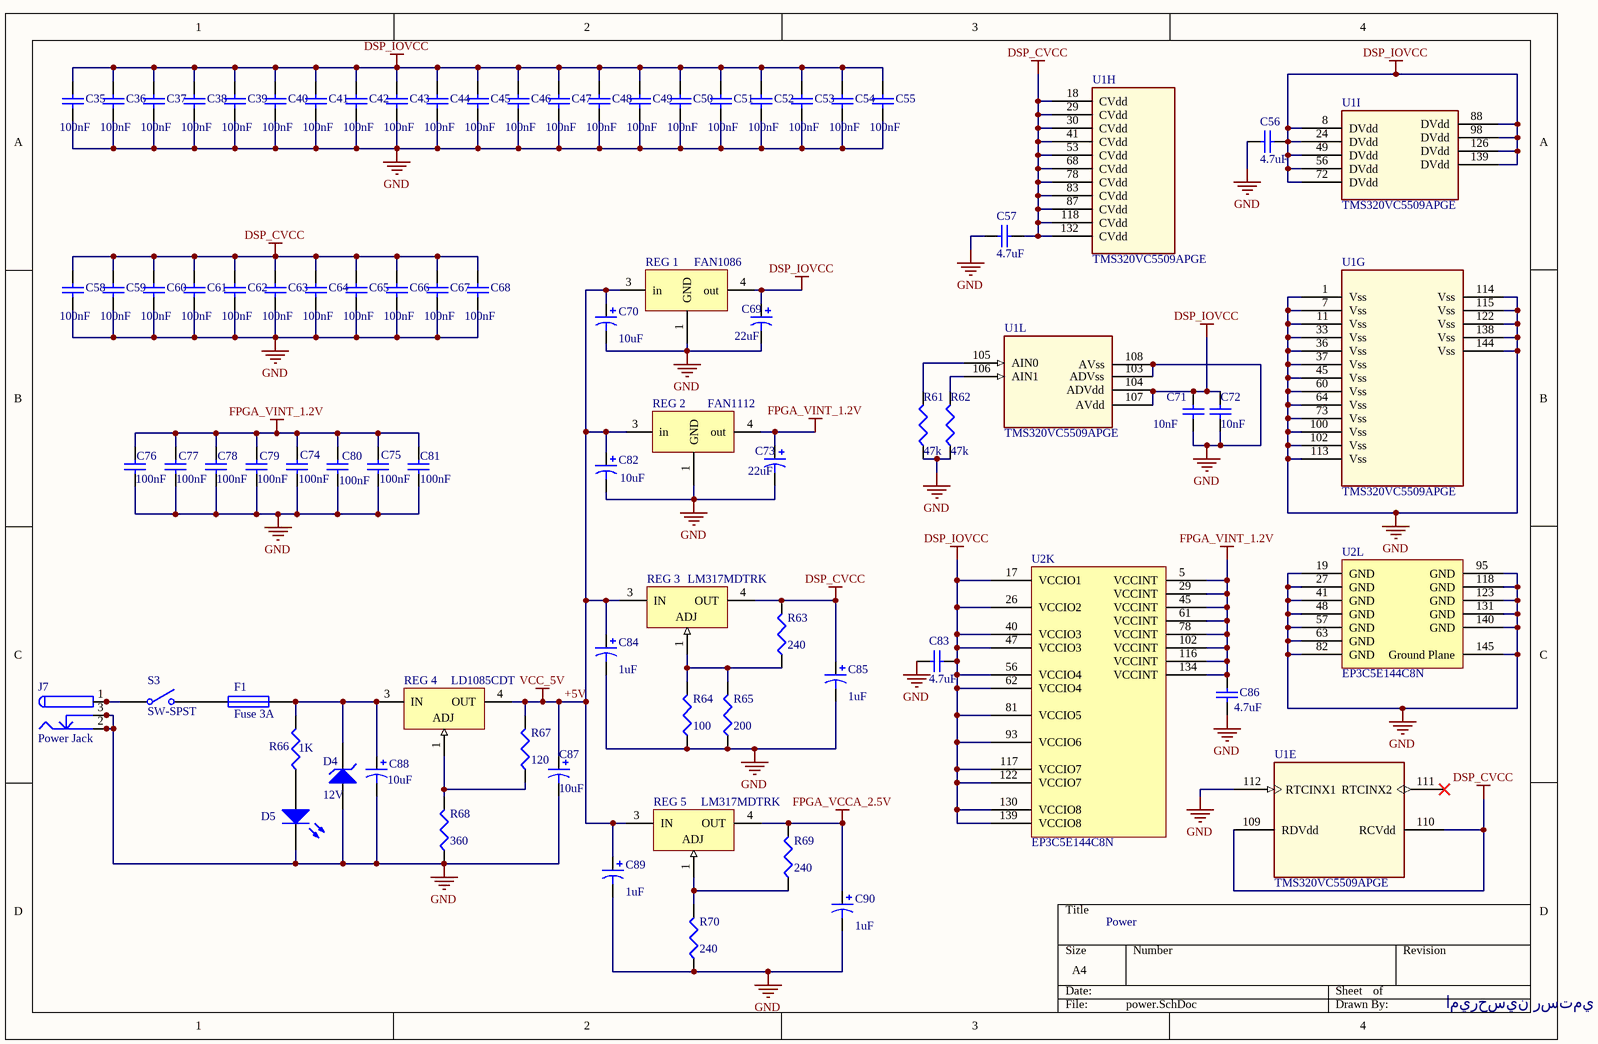
[diagram p6: power.SchDoc]

### Parts
C35  100nF  [1608[0603]]
C36  100nF  [1608[0603]]
C37  100nF  [1608[0603]]
C38  100nF  [1608[0603]]
C39  100nF  [1608[0603]]
C40  100nF  [1608[0603]]
C41  100nF  [1608[0603]]
C42  100nF  [1608[0603]]
C43  100nF  [1608[0603]]
C44  100nF  [1608[0603]]
C45  100nF  [1608[0603]]
C46  100nF  [1608[0603]]
C47  100nF  [1608[0603]]
C48  100nF  [1608[0603]]
C49  100nF  [1608[0603]]
C50  100nF  [1608[0603]]
C51  100nF  [1608[0603]]
C52  100nF  [1608[0603]]
C53  100nF  [1608[0603]]
C54  100nF  [1608[0603]]
C55  100nF  [1608[0603]]
C56  4.7uF  [1608[0603]]
C57  4.7uF  [1608[0603]]
C58  100nF  [1608[0603]]
C59  100nF  [1608[0603]]
C60  100nF  [1608[0603]]
C61  100nF  [1608[0603]]
C62  100nF  [1608[0603]]
C63  100nF  [1608[0603]]
C64  100nF  [1608[0603]]
C65  100nF  [1608[0603]]
C66  100nF  [1608[0603]]
C67  100nF  [1608[0603]]
C68  100nF  [1608[0603]]
C69  22uF  [C1206]
C70  10uF  [C1206]
C71  value 10nF  [1608[0603]]  (hidden comment: 1onF)
C72  10nF  [1608[0603]]
C73  22uF  [C1206]
C74  100nF  [1608[0603]]
C75  100nF  [1608[0603]]
C76  100nF  [1608[0603]]
C77  100nF  [1608[0603]]
C78  100nF  [1608[0603]]
C79  100nF  [1608[0603]]
C80  100nF  [1608[0603]]
C81  100nF  [1608[0603]]
C82  10uF  [C1206]
C83  4.7uF  [1608[0603]]
C84  1uF  [C1206]
C85  1uF  [C1206]
C86  4.7uF  [1608[0603]]
C87  value 10uF  [C1206]  (hidden comment: 22uF)
C88  10uF  [C1206]
C89  1uF  [C1206]
C90  1uF  [C1206]
D4  12V  [MELF-D3512-1405]
D5  LED green  [1.6X0.8X0.4]  (value not drawn)
F1  Fuse 3A  [2012[0805]]
J7  Power Jack  [KLD-0202]
R61  47K  [J1-0603]
R62  47k  [J1-0603]
R63  240  [J1-0603]
R64  100  [J1-0603]
R65  200  [J1-0603]
R66  1K  [J1-0603]
R67  120  [J1-0603]
R68  360  [J1-0603]
R69  240  [J1-0603]
R70  240  [J1-0603]
REG_1  FAN1086  [369A-13]
REG_2  FAN1112  [369A-13]
REG_3  LM317MDTRK  [369A-13]
REG_4  LD1085CDT  [369A-13]
REG_5  LM317MDTRK  [369A-13]
S3  SW-SPST  [DIP_SW_1]
U1  TMS320VC5509APGE  [TMSVC5509APGA]  (parts E,G,H,I,L of 16)
U2  EP3C5E144C8N  [EQFP144_N]  (parts K,L of 13)

### Nets
+5V: C70.1 C82.1 C84.1 C87.1 C89.1 R67.2 REG_1.3(in) REG_2.3(in) REG_3.3(IN) REG_4.4(OUT) REG_5.3(IN)  [also labelled VCC_5V]
DSP_CVCC: C57.2 C58.1 C59.1 C60.1 C61.1 C62.1 C63.1 C64.1 C65.1 C66.1 C67.1 C68.1 C85.1 R63.2 REG_3.4(OUT) U1.18(CVdd) U1.29(CVdd) U1.30(CVdd) U1.41(CVdd) U1.53(CVdd) U1.68(CVdd) U1.78(CVdd) U1.83(CVdd) U1.87(CVdd) U1.109(RDVdd) U1.110(RCVdd) U1.118(CVdd) U1.132(CVdd)
DSP_IOVCC: C35.1 C36.1 C37.1 C38.1 C39.1 C40.1 C41.1 C42.1 C43.1 C44.1 C45.1 C46.1 C47.1 C48.1 C49.1 C50.1 C51.1 C52.1 C53.1 C54.1 C55.1 C56.2 C69.1 C71.1 C72.1 C83.1 REG_1.4(out) U1.8(DVdd) U1.24(DVdd) U1.49(DVdd) U1.56(DVdd) U1.72(DVdd) U1.88(DVdd) U1.98(DVdd) U1.104(ADVdd) U1.107(AVdd) U1.126(DVdd) U1.139(DVdd) U2.17(VCCIO1) U2.26(VCCIO2) U2.40(VCCIO3) U2.47(VCCIO3) U2.56(VCCIO4) U2.62(VCCIO4) U2.81(VCCIO5) U2.93(VCCIO6) U2.117(VCCIO7) U2.122(VCCIO7) U2.130(VCCIO8) U2.139(VCCIO8)  [project net +3.3V]
FPGA_VCCA_2.5V: C90.1 R69.2 REG_5.4(OUT)
FPGA_VINT_1.2V: C73.1 C74.1 C75.1 C76.1 C77.1 C78.1 C79.1 C80.1 C81.1 C86.2 REG_2.4(out) U2.5(VCCINT) U2.29(VCCINT) U2.45(VCCINT) U2.61(VCCINT) U2.78(VCCINT) U2.102(VCCINT) U2.116(VCCINT) U2.134(VCCINT)
GND: C35.2 C36.2 C37.2 C38.2 C39.2 C40.2 C41.2 C42.2 C43.2 C44.2 C45.2 C46.2 C47.2 C48.2 C49.2 C50.2 C51.2 C52.2 C53.2 C54.2 C55.2 C56.1 C57.1 C58.2 C59.2 C60.2 C61.2 C62.2 C63.2 C64.2 C65.2 C66.2 C67.2 C68.2 C69.2 C70.2 C71.2 C72.2 C73.2 C74.2 C75.2 C76.2 C77.2 C78.2 C79.2 C80.2 C81.2 C82.2 C83.2 C84.2 C85.2 C86.1 C87.2 C88.2 C89.2 C90.2 D4.1(A) D5.2(K) J7.2 J7.2A J7.2B J7.3 J7.3A J7.3B R61.1 R62.1 R64.1 R65.1 R68.1 R70.1 REG_1.1(GND) REG_2.1(GND) U1.1(Vss) U1.7(Vss) U1.11(Vss) U1.33(Vss) U1.36(Vss) U1.37(Vss) U1.45(Vss) U1.60(Vss) U1.64(Vss) U1.73(Vss) U1.100(Vss) U1.102(Vss) U1.103(ADVss) U1.108(AVss) U1.112(RTCINX1) U1.113(Vss) U1.114(Vss) U1.115(Vss) U1.122(Vss) U1.138(Vss) U1.144(Vss) U2.19(GND) U2.27(GND) U2.41(GND) U2.48(GND) U2.57(GND) U2.63(GND) U2.82(GND) U2.95(GND) U2.118(GND) U2.123(GND) U2.131(GND) U2.140(GND) U2.145(Ground_Plane)
NetC88_1: C88.1 D4.2(K) F1.2 R66.2 REG_4.3(IN)
NetD5_1: D5.1(A) R66.1
NetF1_1: F1.1 S3.2(NO)
NetJ7_1: J7.1 J7.1A J7.1B S3.1(COMMON)
NetR61_2: R61.2 U1.105(AIN0)
NetR62_2: R62.2 U1.106(AIN1)
NetR63_1: R63.1 R64.2 R65.2 REG_3.1(ADJ)
NetR67_1: R67.1 R68.2 REG_4.1(ADJ)
NetR69_1: R69.1 R70.2 REG_5.1(ADJ)

Not connected (* = marked no-connect by the designer): U1 111(RTCINX2)*

### Notes on the sheet
- Power
- اميرحسين رستمي

### Library data of the parts
C35-C68 C71 C72 C74-C81 C83 C86 = Cap Semi: Capacitor; Published: 8-Jun-2000; LatestRevisionDate: 17-Jul-2002; LatestRevisionNote: Re-released for DXP Platform.; PackageReference: C1206; Publisher: Altium Limited
  C35-C55 C58-C68 C74-C81: Value: 100nF
  C56 C57 C83 C86: Value: 4.7uF
  C72: Value: 10nF
C69 C70 C73 C82 C84 C85 C87-C90 = Cap Pol3: Polarized Capacitor (Tantalium); Published: 8-Jun-2000; LatestRevisionDate: 17-Jul-2002; LatestRevisionNote: Re-released for DXP Platform.; PackageReference: C0805; Publisher: Altium Limited
  C69 C73: Value: 22uF
  C70 C82 C88: Value: 10uF
  C84 C85 C89 C90: Value: 1uF
D4 = DL4742A: Silicon Zener Diode; Published: 8-Jun-2000; LatestRevisionDate: 19-Mar-2004; LatestRevisionNote: Silkscreen size reduced.; PackageReference: DL-41; Publisher: Altium Limited; Code_IPC: SOD-87/MLL41; ComponentLink1Description: Manufacturer Link; ComponentLink1URL: http://www.vishay.com/
D5 = LED3: Typical BLUE SiC LED; Published: 8-Jun-2000; LatestRevisionDate: 17-Dec-2003; LatestRevisionNote: PCB Footprint replaced.; DatasheetDocument: 16-Apr-2002; PackageDocument: 16-Apr-2002; PackageReference: 3.5X2.8X1.9; Publisher: Altium Limited
F1 = Fuse 1: Fuse; Published: 8-Jun-2000; LatestRevisionDate: 17-Jul-2002; LatestRevisionNote: Re-released for DXP Platform.; PackageReference: PIN-W2/E2.8; Publisher: Altium Limited
J7 = PWR2.5: Low Voltage Power Supply Connector; Published: 17-Dec-2003; DatasheetDocument: 09-May-2002; Publisher: Altium Limited; ComponentLink1Description: Manufacturer Link; ComponentLink1URL: http://domino.kycon.com/internet/Products.html
R61-R70 = Res3: Resistor; Published: 8-Jun-2000; LatestRevisionDate: 04-Mar-2005; LatestRevisionNote: PCB Footprint replaced.; PackageReference: J1-0603; Publisher: Altium Limited
  R61 R62: Value: 47k
  R63 R69 R70: Value: 240
  R64: Value: 100
  R65: Value: 200
  R66: Value: 1K
  R67: Value: 120
  R68: Value: 360
REG_1 = FAN1086: 1.5A, 3.3V Fixed Low Dropout Linear Regulator
REG_2 = FAN1112: 1A 1.2V Low Dropout Linear Regulator
REG_3 REG_5 = LM317MDTRK: Three-Terminal Adjustable Output Positive Voltage Regulator; Note: Pin 2 is electrically connected to Pin 4 (TAB); Pin 2 is trimmed and not drawn; Published: 15-Apr-2002; DatasheetVersion: Nov-1999; PackageVersion: 1997; PackageReference: 369A-13; Publisher: Altium Limited; PackageDescription: D-PAK/TO-252-AA; 3 Leads (1 Cropped); Body 10.3 (inc. leads) x 6.7 mm (LxW max); ComponentLink1Description: Manufacturer Link; ComponentLink1URL: http://www.onsemi.com/site/products/taxonomy/0,4438,503,00.html; ComponentLink2Description: Datasheet; ComponentLink2URL: http://www.onsemi.com/pub/Collateral/LM317M-D.PDF
REG_4 = LM317MDT: Three-Terminal Adjustable Output Positive Voltage Regulator; Note: Pin 2 is electrically connected to Pin 4 (TAB); Pin 2 is trimmed and not drawn; Published: 15-Apr-2002; DatasheetVersion: Nov-1999; PackageVersion: 1997; PackageReference: 369A-13; Publisher: Altium Limited; PackageDescription: D-PAK/TO-252-AA; 3 Leads (1 Cropped); Body 10.3 (inc. leads) x 6.7 mm (LxW max); ComponentLink1Description: Manufacturer Link; ComponentLink1URL: http://www.onsemi.com/site/products/taxonomy/0,4438,503,00.html; ComponentLink2Description: Datasheet; ComponentLink2URL: http://www.onsemi.com/pub/Collateral/LM317M-D.PDF
S3 = SW-SPST: Single-Pole, Single-Throw Switch; Published: 24-Mar-1999; LatestRevisionDate: 17-Jul-2002; LatestRevisionNote: Re-released for DXP Platform.; PackageReference: SPST-2; Publisher: Altium Limited
U2 = EP3C5E144C8N: as U2 on sheet DSP_FPGA; Published: 14-Mar-2008; LatestRevisionDate: 27-Jun-2008; LatestRevisionNote: Sch pin for exposed pad added.; DatasheetVersion: ver2.0, May-2008; PackageVersion: ver15.1, May-2008; PackageReference: EQFP144; Publisher: Altium Limited; PackageDescription: 144-Pin Plastic Enhanced Quad Flat Pack (EQFP144) - Wire Bond; Code_JEDEC: MS-026-BFB; ComponentLink1Description: Manufacturer Link; ComponentLink1URL: http://www.altera.com/; ComponentLink2Description: Handbook (7.86MB); ComponentLink2URL: http://www.altera.com/literature/hb/cyc3/cyclone3_handbook.pdf; ComponentLink3Description: Packaging Specification; ComponentLink3URL: http://www.altera.com/literature/ds/dspkg.pdf

## Sheet microSD.SchDoc
size A4
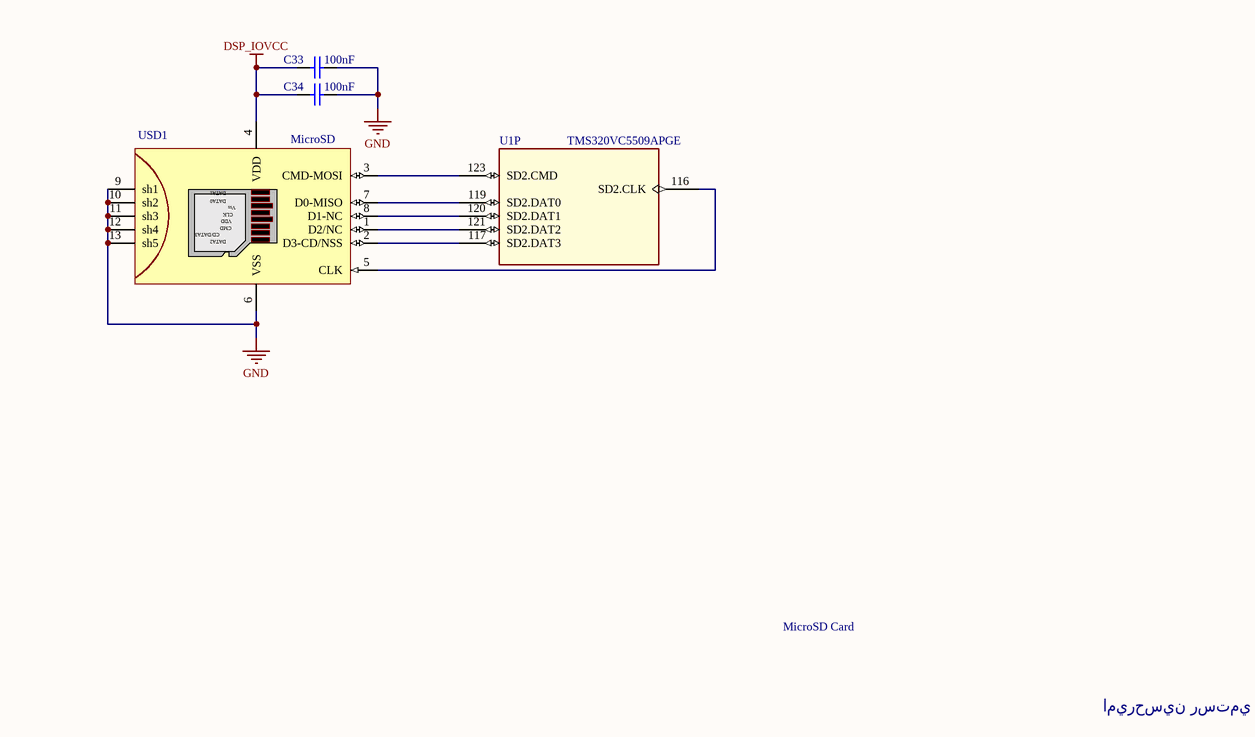
[diagram p7: microSD.SchDoc]

### Parts
C33  100nF  [1608[0603]]
C34  100nF  [1608[0603]]
U1  TMS320VC5509APGE  [TMSVC5509APGA]  (part P of 16)
USD1  MicroSD  [SD_MMC_SOCKET]

### Nets
DSP_IOVCC: C33.2 C34.2 USD1.4(VDD)  [project net +3.3V]
GND: C33.1 C34.1 USD1.6(VSS) USD1.9(sh1) USD1.10(sh2) USD1.11(sh3) USD1.12(sh4) USD1.13(sh5)
NetU1_116: U1.116(SD2.CLK) USD1.5(CLK)
NetU1_117: U1.117(SD2.DAT3) USD1.2(D3-CD/NSS)
NetU1_119: U1.119(SD2.DAT0) USD1.7(D0-MISO)
NetU1_120: U1.120(SD2.DAT1) USD1.8(D1-NC)
NetU1_121: U1.121(SD2.DAT2) USD1.1(D2/NC)
NetU1_123: U1.123(SD2.CMD) USD1.3(CMD-MOSI)

### Notes on the sheet
- MicroSD Card
- اميرحسين رستمي
- (in symbol MicroSD) DATA1; DATA0; Vss; CMD; CD/DATA3; DATA2

### Library data of the parts
C33 C34 = Cap Semi: Capacitor; Published: 8-Jun-2000; LatestRevisionDate: 17-Jul-2002; LatestRevisionNote: Re-released for DXP Platform.; PackageReference: C1206; Publisher: Altium Limited; Value: 100nF

## Sheet FPGA_IO.SchDoc
size A4
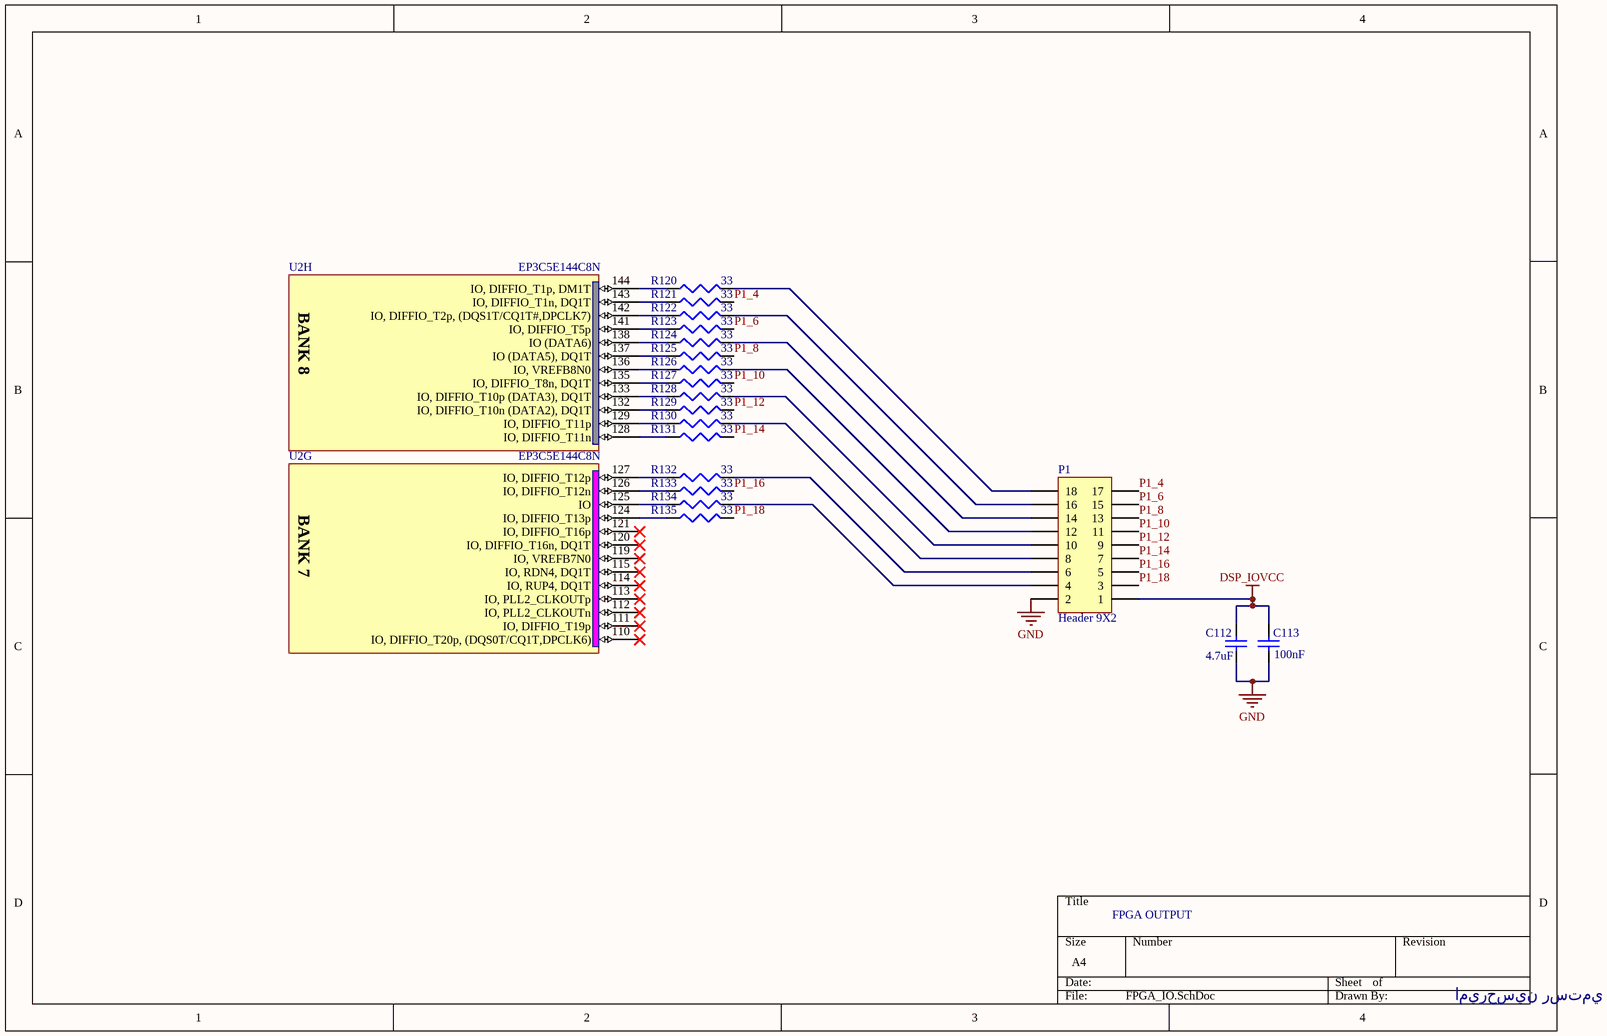
[diagram p8: FPGA_IO.SchDoc]

### Parts
C112  4.7uF  [1608[0603]]
C113  100nF  [1608[0603]]
P1  Header 9X2  [HDR2X9]
R120  33  [J1-0603]
R121  33  [J1-0603]
R122  33  [J1-0603]
R123  33  [J1-0603]
R124  33  [J1-0603]
R125  33  [J1-0603]
R126  33  [J1-0603]
R127  33  [J1-0603]
R128  33  [J1-0603]
R129  33  [J1-0603]
R130  33  [J1-0603]
R131  33  [J1-0603]
R132  33  [J1-0603]
R133  33  [J1-0603]
R134  33  [J1-0603]
R135  33  [J1-0603]
U2  EP3C5E144C8N  [EQFP144_N]  (parts G,H of 13)

### Nets
DSP_IOVCC: C112.2 C113.2 P1.1  [project net +3.3V]
GND: C112.1 C113.1 P1.2
P1_4: P1.17 R121.2
P1_6: P1.15 R123.2
P1_8: P1.13 R125.2
P1_10: P1.11 R127.2
P1_12: P1.9 R129.2
P1_14: P1.7 R131.2
P1_16: P1.5 R133.2
P1_18: P1.3 R135.2
NetP1_4: P1.4 R134.2
NetP1_6: P1.6 R132.2
NetP1_8: P1.8 R130.2
NetP1_10: P1.10 R128.2
NetP1_12: P1.12 R126.2
NetP1_14: P1.14 R124.2
NetP1_16: P1.16 R122.2
NetP1_18: P1.18 R120.2
NetR120_1: R120.1 U2.144(IO,_DIFFIO_T1p,_DM1T)
NetR121_1: R121.1 U2.143(IO,_DIFFIO_T1n,_DQ1T)
NetR122_1: R122.1 U2.142(IO,_DIFFIO_T2p,_(DQS1T/CQ1T#,DPCLK7))
NetR123_1: R123.1 U2.141(IO,_DIFFIO_T5p)
NetR124_1: R124.1 U2.138(IO_(DATA6))
NetR125_1: R125.1 U2.137(IO_(DATA5),_DQ1T)
NetR126_1: R126.1 U2.136(IO,_VREFB8N0)
NetR127_1: R127.1 U2.135(IO,_DIFFIO_T8n,_DQ1T)
NetR128_1: R128.1 U2.133(IO,_DIFFIO_T10p_(DATA3),_DQ1T)
NetR129_1: R129.1 U2.132(IO,_DIFFIO_T10n_(DATA2),_DQ1T)
NetR130_1: R130.1 U2.129(IO,_DIFFIO_T11p)
NetR131_1: R131.1 U2.128(IO,_DIFFIO_T11n)
NetR132_1: R132.1 U2.127(IO,_DIFFIO_T12p)
NetR133_1: R133.1 U2.126(IO,_DIFFIO_T12n)
NetR134_1: R134.1 U2.125(IO)
NetR135_1: R135.1 U2.124(IO,_DIFFIO_T13p)

Not connected (* = marked no-connect by the designer): U2 110(IO,_DIFFIO_T20p,_(DQS0T/CQ1T,DPCLK6))* 111(IO,_DIFFIO_T19p)* 112(IO,_PLL2_CLKOUTn)* 113(IO,_PLL2_CLKOUTp)* 114(IO,_RUP4,_DQ1T)* 115(IO,_RDN4,_DQ1T)* 119(IO,_VREFB7N0)* 120(IO,_DIFFIO_T16n,_DQ1T)* 121(IO,_DIFFIO_T16p)*

### Notes on the sheet
- FPGA OUTPUT
- اميرحسين رستمي
- (in symbol EP3C5E144C8N, part G) BANK 7
- (in symbol EP3C5E144C8N, part H) BANK 8

### Library data of the parts
C112 C113 = Cap Semi: Capacitor; Published: 8-Jun-2000; LatestRevisionDate: 17-Jul-2002; LatestRevisionNote: Re-released for DXP Platform.; PackageReference: C1206; Publisher: Altium Limited
  C112: Value: 4.7uF
  C113: Value: 100nF
P1 = Header 9X2: Header, 9-Pin, Dual row; LatestRevisionDate: 17-Jul-2002; LatestRevisionNote: Re-released for DXP Platform.; Publisher: Altium Limited
R120-R135 = Res3: Resistor; Published: 8-Jun-2000; LatestRevisionDate: 04-Mar-2005; LatestRevisionNote: PCB Footprint replaced.; PackageReference: J1-0603; Publisher: Altium Limited; Value: 33
U2 = EP3C5E144C8N: as U2 on sheet DSP_FPGA; Published: 14-Mar-2008; LatestRevisionDate: 27-Jun-2008; LatestRevisionNote: Sch pin for exposed pad added.; DatasheetVersion: ver2.0, May-2008; PackageVersion: ver15.1, May-2008; PackageReference: EQFP144; Publisher: Altium Limited; PackageDescription: 144-Pin Plastic Enhanced Quad Flat Pack (EQFP144) - Wire Bond; Code_JEDEC: MS-026-BFB; ComponentLink1Description: Manufacturer Link; ComponentLink1URL: http://www.altera.com/; ComponentLink2Description: Handbook (7.86MB); ComponentLink2URL: http://www.altera.com/literature/hb/cyc3/cyclone3_handbook.pdf; ComponentLink3Description: Packaging Specification; ComponentLink3URL: http://www.altera.com/literature/ds/dspkg.pdf

## Nets that join several sheets
+3.3V: DSP_USB (FB3.2), JTAG (9 pins), McBSP (13 pins), FPGA (8 pins), power (50 pins), microSD (C33.2 C34.2 USD1.4), FPGA_IO (C112.2 C113.2 P1.1)
+5V: McBSP (ADM.2 C27.2 R46.2), FPGA (C111.1 MAX1.7), power (11 pins)
DSP_CVCC: DSP_USB (FB2.1), power (28 pins)
FPGA_VCCA_2.5V: FPGA (5 pins), power (C90.1 R69.2 REG_5.4)
FPGA_VINT_1.2V: FPGA (C91.1 FB15.2), power (19 pins)
GND: DSP_USB (13 pins), JTAG (8 pins), McBSP (22 pins), FPGA (14 pins), power (106 pins), microSD (8 pins), FPGA_IO (C112.1 C113.1 P1.2)
CLK12MHz: McBSP (R59.1 Y1.3), DSP_FPGA (U2.88)
NetR2_2: DSP_USB (R2.2 R6.1), JTAG (U1.6)
NetR27_1: JTAG (U1.142), McBSP (R27.1)
NetR50_1: McBSP (R50.1 U1.93), DSP_FPGA (U2.34)
NetR51_1: McBSP (R51.1 U1.94), DSP_FPGA (U2.33)
NetR52_1: McBSP (R52.1 U1.96), DSP_FPGA (U2.32)
NetR53_1: McBSP (R53.1 U1.97), DSP_FPGA (U2.31)
NetR54_1: McBSP (R54.1 U1.99), DSP_FPGA (U2.30)
NetR145_2: McBSP (R145.2 R146.1 U1.91), DSP_FPGA (U2.87)